# Altium project pay-optical.PrjPCB (part 1 of 2)
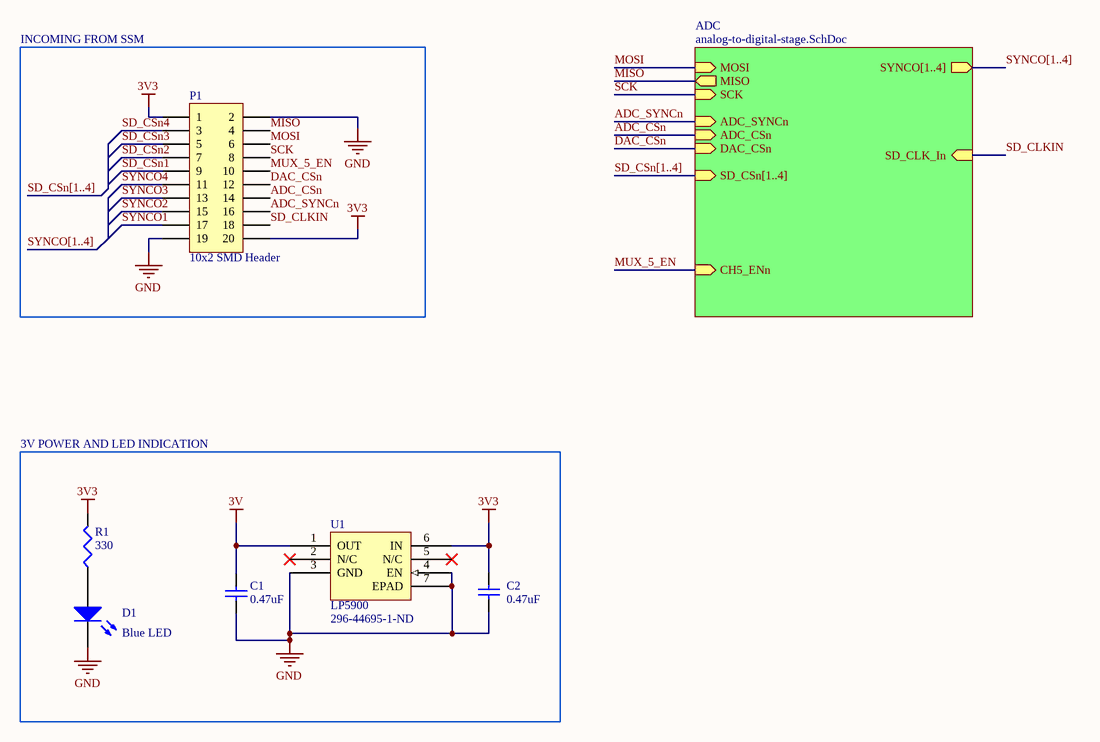
[diagram p0: pay-optical-toplevel.SchDoc]
13 sheets, 470 parts. Net scope: hierarchical (ports join the sheet entries above them; power ports are global).
Board files: pay-optical.PcbDoc, pay-optical-testing.PcbDoc
Sheets:
  pay-optical-toplevel.SchDoc
    ADC = analog-to-digital-stage.SchDoc
      ADC Converter = adc-ic.SchDoc
      Synchronous Demodulator Circuit = synchronous-demodulator.SchDoc
        CH1 = tia-channel-selection.SchDoc
          TIA_Signal_Mux = multiplexer-ic.SchDoc
          TIA1 = photodiode-amplifier.SchDoc
          TIA2 = photodiode-amplifier.SchDoc
          TIA3 = photodiode-amplifier.SchDoc
          TIA4 = photodiode-amplifier.SchDoc
          TIA5 = photodiode-amplifier.SchDoc
          TIA6 = photodiode-amplifier.SchDoc
          TIA7 = photodiode-amplifier.SchDoc
          TIA8 = photodiode-amplifier.SchDoc
          LED_Signal_Mux = multiplexer-ic.SchDoc
        CH2 = tia-channel-selection.SchDoc
          TIA_Signal_Mux = multiplexer-ic.SchDoc
          TIA1 = photodiode-amplifier.SchDoc
          TIA2 = photodiode-amplifier.SchDoc
          TIA3 = photodiode-amplifier.SchDoc
          TIA4 = photodiode-amplifier.SchDoc
          TIA5 = photodiode-amplifier.SchDoc
          TIA6 = photodiode-amplifier.SchDoc
          TIA7 = photodiode-amplifier.SchDoc
          TIA8 = photodiode-amplifier.SchDoc
          LED_Signal_Mux = multiplexer-ic.SchDoc
        CH3 = tia-channel-selection.SchDoc
          TIA_Signal_Mux = multiplexer-ic.SchDoc
          TIA1 = photodiode-amplifier.SchDoc
          TIA2 = photodiode-amplifier.SchDoc
          TIA3 = photodiode-amplifier.SchDoc
          TIA4 = photodiode-amplifier.SchDoc
          TIA5 = photodiode-amplifier.SchDoc
          TIA6 = photodiode-amplifier.SchDoc
          TIA7 = photodiode-amplifier.SchDoc
          TIA8 = photodiode-amplifier.SchDoc
          LED_Signal_Mux = multiplexer-ic.SchDoc
        SD1 = sync-demod-ic.SchDoc
        SD2 = sync-demod-ic.SchDoc
        SD3 = sync-demod-ic.SchDoc
        SD4 = sync-demod-ic.SchDoc
        HP_FILTER1 = highpass-filter-conditioning.SchDoc
        HP_FILTER2 = highpass-filter-conditioning.SchDoc
        HP_FILTER3 = highpass-filter-conditioning.SchDoc
        HP_FILTER4 = highpass-filter-conditioning.SchDoc
        CH4 = tia-channel-selection.SchDoc
          TIA_Signal_Mux = multiplexer-ic.SchDoc
          TIA1 = photodiode-amplifier.SchDoc
          TIA2 = photodiode-amplifier.SchDoc
          TIA3 = photodiode-amplifier.SchDoc
          TIA4 = photodiode-amplifier.SchDoc
          TIA5 = photodiode-amplifier.SchDoc
          TIA6 = photodiode-amplifier.SchDoc
          TIA7 = photodiode-amplifier.SchDoc
          TIA8 = photodiode-amplifier.SchDoc
          LED_Signal_Mux = multiplexer-ic.SchDoc
        CH5 = special-channel-selection.SchDoc
          TIA_Signal_Mux = multiplexer-ic.SchDoc
          TIA_S1 = photodiode-amplifier.SchDoc
          TIA_S2 = photodiode-amplifier.SchDoc
          LED_Signal_Mux = multiplexer-ic.SchDoc
          SMA Amp = sma-amplifier.SchDoc
      LPF_P1 = lowpass-adc-input.SchDoc
      LPF_P2 = lowpass-adc-input.SchDoc
      LPF_P3 = lowpass-adc-input.SchDoc
      LPF_P4 = lowpass-adc-input.SchDoc
      Designator = dac-ic.SchDoc
      LPF_N1 = lowpass-adc-input.SchDoc
      LPF_N2 = lowpass-adc-input.SchDoc
      LPF_N3 = lowpass-adc-input.SchDoc
      LPF_N4 = lowpass-adc-input.SchDoc

## Sheet pay-optical-toplevel.SchDoc: PAY Optical Top Level
size A4; DrawnBy: Dylan Vogel; Organization: UTAT SS; DocumentNumber: 1; Revision: 2; SheetNumber: 1; SheetTotal: 13

### Parts
C1  0.47uF  [1608[0603]]
C2  0.47uF  [1608[0603]]
D1  Blue LED  [0603-LED]
P1  10x2 SMD Header  [CON20_2X10_DUA00]
R1  330  [0402]
U1  LP5900  Supplier Part Number 1: 296-44695-1-ND  [DFN220X250X80-7N]

### Blocks framed on the sheet
INCOMING FROM SSM: P1
3V POWER AND LED INDICATION: C1 C2 D1 R1 U1

### Sub-sheets
ADC = analog-to-digital-stage.SchDoc: SCK (in), MISO (out), MOSI (in), ADC_SYNCn (in), ADC_CSn (in), DAC_CSn (in), CH5_ENn (in), SD_CLK_In (in), SD_CSn[1..4] (in), SYNCO[1..4] (out)

### Nets
3V: C1.2 U1.1(OUT)
3V3: C2.2 P1.1 P1.20 R1.2 U1.6(IN)
GND: C1.1 C2.1 D1.2(K) P1.2 P1.19 U1.3(GND) U1.4(EN) U1.7(EPAD)
ADC_CSn: P1.14 ; sheet ADC/ADC_CSn
ADC_SYNCn: P1.16 ; sheet ADC/ADC_SYNCn
DAC_CSn: P1.12 ; sheet ADC/DAC_CSn
MISO: P1.4 ; sheet ADC/MISO
MOSI: P1.6 ; sheet ADC/MOSI
MUX_5_EN: P1.10 ; sheet ADC/CH5_ENn
SCK: P1.8 ; sheet ADC/SCK
SD_CLKIN: P1.18 ; sheet ADC/SD_CLK_In
SD_CSn1: P1.9
SD_CSn2: P1.7
SD_CSn3: P1.5
SD_CSn4: P1.3
SYNCO1: P1.17
SYNCO2: P1.15
SYNCO3: P1.13
SYNCO4: P1.11
NetD1_1: D1.1(A) R1.1

Not connected (* = marked no-connect by the designer): U1 2(N/C)* 5(N/C)*

### Buses and harness runs
bus SD_CSn[1..4]
bus SD_CSn[1..4] = sheet ADC/SD_CSn[1..4]
bus SYNCO[1..4]
bus SYNCO[1..4] = sheet ADC/SYNCO[1..4]

### Library data of the parts
C1 C2 = Cap Semi: Capacitor (Semiconductor SIM Model); Published: 8-Jun-2000; LatestRevisionDate: 29-May-2009; LatestRevisionNote: IPC-7351 Footprint Added.; PackageReference: C1206; Publisher: Altium Limited; PackageDescription: Chip Capacitor; Value: 0.47uF; Supplier: Digi-Key; Supplier 1: Digi-Key
D1 = LED2: Typical RED, GREEN, YELLOW, AMBER GaAs LED; Published: 8-Jun-2000; LatestRevisionDate: 17-Jul-2002; LatestRevisionNote: Re-released for DXP Platform.; PackageVersion: Feb-2002; PackageReference: 3.2X1.6X1.1; Publisher: Altium Limited; PackageDescription: SM LED; 2 Flat Leads; Supplier 1: Digi-Key
P1 = Header 10X2: 10x2 SMD 50mil Incoming from SSM; LatestRevisionDate: 17-Jul-2002; LatestRevisionNote: Re-released for DXP Platform.; Publisher: Altium Limited; Supplier 1: Digi-Key; Supplier Part Number 1: SAM11274-ND
R1 = Res3: Power indication LED; Published: 8-Jun-2000; LatestRevisionDate: 29-May-2009; LatestRevisionNote: IPC-7351 Footprint Added.; PackageReference: J1-0603; Publisher: Altium Limited; PackageDescription: Chip Resistor; Value: 330; Supplier 1: Digi-Key
U1 = LP5900: Low noise 3V low dropout regulator for analog and RF applications.; Supplier 1: Digi-Key

## Sheet analog-to-digital-stage.SchDoc: ADC Top Level
size A4; DrawnBy: Dylan Vogel; Organization: UTAT SS; DocumentNumber: 2; Revision: 2; SheetNumber: 2; SheetTotal: 13
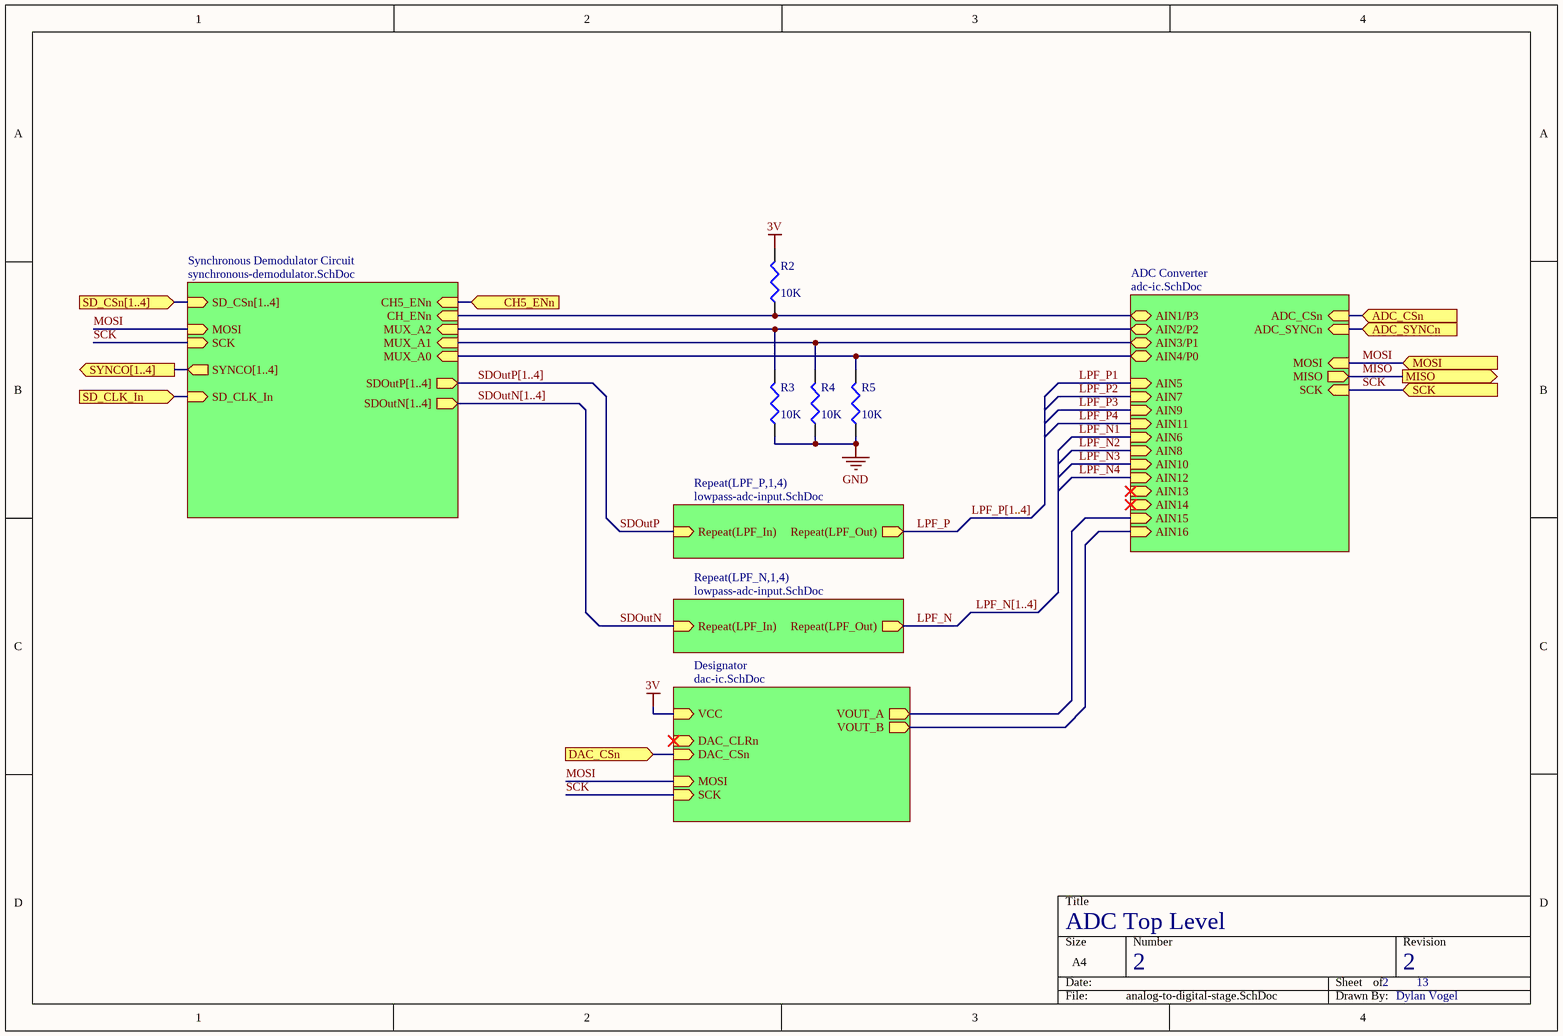
[diagram p1: analog-to-digital-stage.SchDoc]

### Parts
R2  10K  [J1-0603]
R3  10K  [J1-0603]
R4  10K  [J1-0603]
R5  10K  [J1-0603]

### Sub-sheets
ADC Converter = adc-ic.SchDoc: AIN6 (in), MISO (out), AIN3/P1 (bidir), AIN11 (in), ADC_CSn (in), ADC_SYNCn (in), AIN1/P3 (bidir), AIN5 (in), SCK (in), AIN2/P2 (bidir), AIN8 (in), MOSI (in), AIN12 (in), AIN14 (in), AIN9 (in), AIN10 (in), AIN7 (in), AIN16 (in), AIN13 (in), AIN15 (in), AIN4/P0 (bidir)
Designator = dac-ic.SchDoc: VCC (in), DAC_CLRn (in), MOSI (in), SCK (in), DAC_CSn (in), VOUT_B (out), VOUT_A (out)
Repeat(LPF_N,1,4) = lowpass-adc-input.SchDoc: Repeat(LPF_Out) (out), Repeat(LPF_In) (in)
Repeat(LPF_P,1,4) = lowpass-adc-input.SchDoc: Repeat(LPF_Out) (out), Repeat(LPF_In) (in)
Synchronous Demodulator Circuit = synchronous-demodulator.SchDoc: SCK (in), MUX_A0 (in), MUX_A1 (in), CH_ENn (in), MOSI (in), CH5_ENn (in), MUX_A2 (in), SD_CLK_In (in), SD_CSn[1..4] (in), SDOutN[1..4] (out), SDOutP[1..4] (out), SYNCO[1..4] (out)

### Ports
ADC_CSn (in), ADC_SYNCn (in), CH5_ENn (in), DAC_CSn (in), MISO (out), MOSI (in), SCK (in), SD_CLK_In (in), SD_CSn[1..4] (in), SYNCO[1..4] (out)

### Nets
3V: R2.2 ; sheet Designator/VCC
GND: R3.1 R4.1 R5.1
ADC_CSn: port ADC_CSn, sheet ADC Converter/ADC_CSn
ADC_SYNCn: port ADC_SYNCn, sheet ADC Converter/ADC_SYNCn
AIN1/P3: R2.1 ; sheet ADC Converter/AIN1/P3, sheet Synchronous Demodulator Circuit/CH_ENn
AIN2/P2: R3.2 ; sheet ADC Converter/AIN2/P2, sheet Synchronous Demodulator Circuit/MUX_A2
AIN3/P1: R4.2 ; sheet ADC Converter/AIN3/P1, sheet Synchronous Demodulator Circuit/MUX_A1
AIN4/P0: R5.2 ; sheet ADC Converter/AIN4/P0, sheet Synchronous Demodulator Circuit/MUX_A0
AIN15: sheet ADC Converter/AIN15, sheet Designator/VOUT_A
AIN16: sheet ADC Converter/AIN16, sheet Designator/VOUT_B
DAC_CSn: port DAC_CSn, sheet Designator/DAC_CSn
LPF_N: sheet Repeat(LPF_N,1,4)/Repeat(LPF_Out)
LPF_P: sheet Repeat(LPF_P,1,4)/Repeat(LPF_Out)
MISO: port MISO, sheet ADC Converter/MISO
MOSI: port MOSI, sheet ADC Converter/MOSI, sheet Synchronous Demodulator Circuit/MOSI, sheet Designator/MOSI
MUX_5_EN: port CH5_ENn, sheet Synchronous Demodulator Circuit/CH5_ENn
SCK: port SCK, sheet ADC Converter/SCK, sheet Synchronous Demodulator Circuit/SCK, sheet Designator/SCK
SD_CLKIN: port SD_CLK_In, sheet Synchronous Demodulator Circuit/SD_CLK_In
SDOutN: sheet Repeat(LPF_N,1,4)/Repeat(LPF_In)
SDOutP: sheet Repeat(LPF_P,1,4)/Repeat(LPF_In)

### Buses and harness runs
bus LPF_N[1..4]
bus LPF_P[1..4]
bus port SD_CSn[1..4] = sheet Synchronous Demodulator Circuit/SD_CSn[1..4]
bus port SYNCO[1..4] = sheet Synchronous Demodulator Circuit/SYNCO[1..4]
bus SDOutN[1..4] = sheet Synchronous Demodulator Circuit/SDOutN[1..4]
bus SDOutP[1..4] = sheet Synchronous Demodulator Circuit/SDOutP[1..4]

### Library data of the parts
R2 = Res3: 10K pull-up for MUX ENn pin; Published: 8-Jun-2000; LatestRevisionDate: 29-May-2009; LatestRevisionNote: IPC-7351 Footprint Added.; PackageReference: J1-0603; Publisher: Altium Limited; PackageDescription: Chip Resistor; Value: 10K
R3-R5 = Res3: 10K pulldown on MUX channel selection; Published: 8-Jun-2000; LatestRevisionDate: 29-May-2009; LatestRevisionNote: IPC-7351 Footprint Added.; PackageReference: J1-0603; Publisher: Altium Limited; PackageDescription: Chip Resistor; Value: 10K

## Sheet adc-ic.SchDoc: AD7194
size A4; DrawnBy: Dylan Vogel; Organization: UTAT SS; DocumentNumber: 3; Revision: 2; SheetNumber: 3; SheetTotal: 13
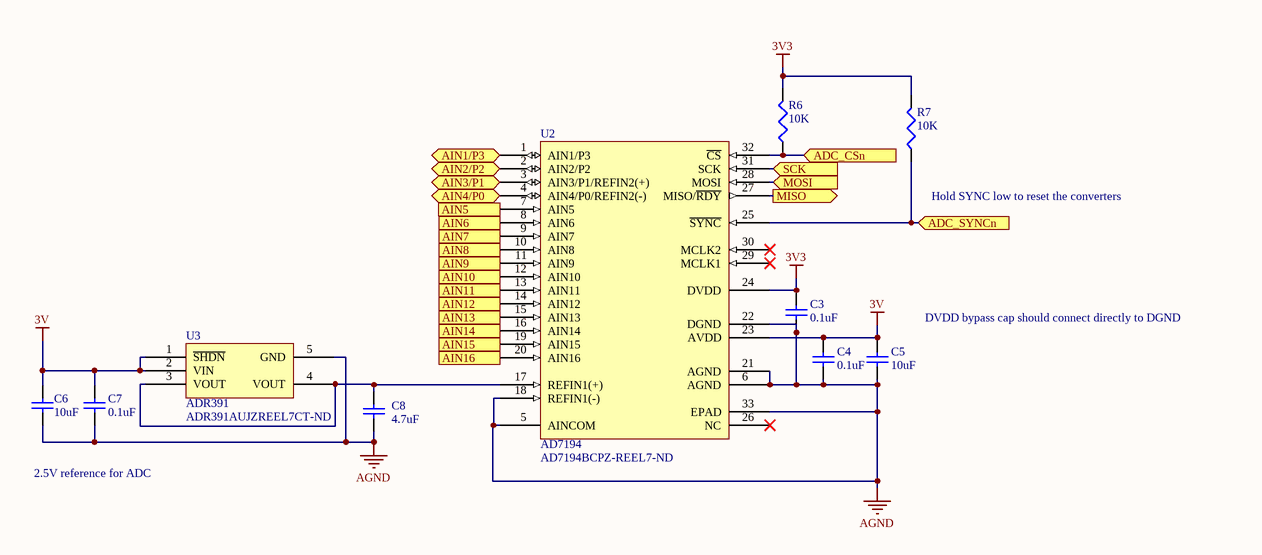
[diagram p2: adc-ic.SchDoc]

### Parts
C3  0.1uF  [0402]
C4  0.1uF  [0402]
C5  10uF  [1608[0603]]
C6  10uF  [1608[0603]]
C7  0.1uF  [0402]
C8  4.7uF  [1608[0603]]
R6  10K  [0402]
R7  10K  [0402]
U2  AD7194  Supplier Part Number 1: AD7194BCPZ-REEL7-ND
U3  ADR391  Supplier Part Number 1: ADR391AUJZREEL7CT-ND  [SOT-23-5_95P290X160-5N]

### Ports
ADC_CSn (in), ADC_SYNCn (in), AIN1/P3 (bidir), AIN2/P2 (bidir), AIN3/P1 (bidir), AIN4/P0 (bidir), AIN5 (in), AIN6 (in), AIN7 (in), AIN8 (in), AIN9 (in), AIN10 (in), AIN11 (in), AIN12 (in), AIN13 (in), AIN14 (in), AIN15 (in), AIN16 (in), MISO (out), MOSI (in), SCK (in)

### Nets
3V: C4.2 C5.2 C6.2 C7.2 U2.23(AVDD) U3.1(~{SHDN}) U3.2(VIN)
3V3: C3.2 R6.2 R7.2 U2.24(DVDD)
AGND: C3.1 C4.1 C5.1 C6.1 C7.1 C8.1 U2.5(AINCOM) U2.6(AGND) U2.18(REFIN1(-)) U2.21(AGND) U2.22(DGND) U2.33(EPAD) U3.5(GND)
ADC_CSn: R6.1 U2.32(~{CS}) ; port ADC_CSn
ADC_SYNCn: R7.1 U2.25(~{SYNC}) ; port ADC_SYNCn
AIN1/P3: U2.1(AIN1/P3) ; port AIN1/P3
AIN2/P2: U2.2(AIN2/P2) ; port AIN2/P2
AIN3/P1: U2.3(AIN3/P1/REFIN2(+)) ; port AIN3/P1
AIN4/P0: U2.4(AIN4/P0/REFIN2(-)) ; port AIN4/P0
AIN13: U2.15(AIN13) ; port AIN13
AIN14: U2.16(AIN14) ; port AIN14
AIN15: U2.19(AIN15) ; port AIN15
AIN16: U2.20(AIN16) ; port AIN16
LPF_N1: U2.8(AIN6) ; port AIN6
LPF_N2: U2.10(AIN8) ; port AIN8
LPF_N3: U2.12(AIN10) ; port AIN10
LPF_N4: U2.14(AIN12) ; port AIN12
LPF_P1: U2.7(AIN5) ; port AIN5
LPF_P2: U2.9(AIN7) ; port AIN7
LPF_P3: U2.11(AIN9) ; port AIN9
LPF_P4: U2.13(AIN11) ; port AIN11
MISO: U2.27(MISO/~{RDY}) ; port MISO
MOSI: U2.28(MOSI) ; port MOSI
SCK: U2.31(SCK) ; port SCK
NetC8_2: C8.2 U2.17(REFIN1(+)) U3.3(VOUT) U3.4(VOUT)

Not connected (* = marked no-connect by the designer): U2 26(NC)* 29(MCLK1)* 30(MCLK2)*

### Notes on the sheet
- (near R7) Hold SYNC low to reset the converters
- DVDD bypass cap should connect directly to DGND
- 2.5V reference for ADC

### Library data of the parts
C3-C8 = Cap Semi: Capacitor (Semiconductor SIM Model); Published: 8-Jun-2000; LatestRevisionDate: 29-May-2009; LatestRevisionNote: IPC-7351 Footprint Added.; PackageReference: C1206; Publisher: Altium Limited; PackageDescription: Chip Capacitor; Supplier: Digi-Key; Supplier 1: Digi-Key
  C3 C4 C7: Value: 0.1uF
  C5 C6: Value: 10uF
  C8: Value: 4.7uF
R6 R7 = Res3: Resistor; Published: 8-Jun-2000; LatestRevisionDate: 29-May-2009; LatestRevisionNote: IPC-7351 Footprint Added.; PackageReference: J1-0603; Publisher: Altium Limited; PackageDescription: Chip Resistor; Value: 10K; Supplier: Digi-Key; Supplier 1: Digi-Key
U2 = AD7194: 24-bit sigma-delta ADC; Supplier 1: Digi-Key
U3 = ADR391: 2.5V reference voltage.; Supplier 1: Digi-Key; Supplier: Digi-Key

## Sheet synchronous-demodulator.SchDoc: SD Top Level
size A4; DrawnBy: Dylan Vogel; Organization: UTAT SS; DocumentNumber: 6; Revision: 2; SheetNumber: 6; SheetTotal: 13
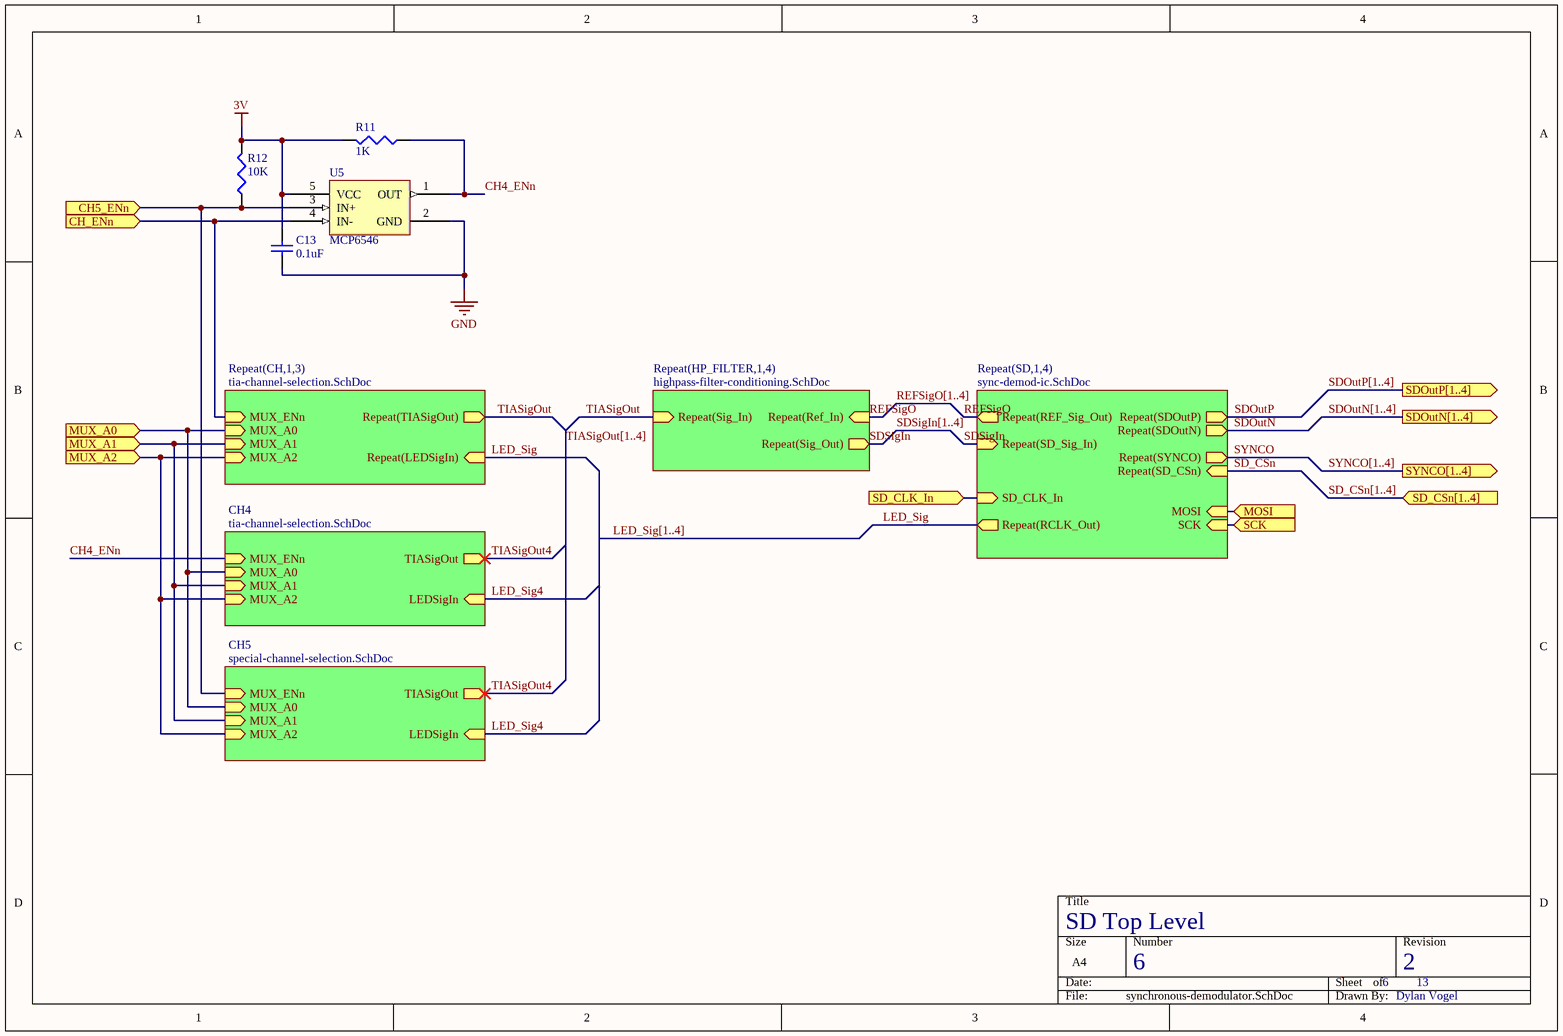
[diagram p3: synchronous-demodulator.SchDoc]

### Parts
C13  0.1uF  [0402]
R11  1K  [0402]
R12  10K  [0402]
U5  MCP6546  [SOT-23-5_95P290X160-5N]

### Sub-sheets
CH4 = tia-channel-selection.SchDoc: MUX_ENn (in), MUX_A0 (in), MUX_A1 (in), TIASigOut (out), MUX_A2 (in), LEDSigIn (in)
CH5 = special-channel-selection.SchDoc: MUX_ENn (in), MUX_A0 (in), MUX_A1 (in), TIASigOut (out), MUX_A2 (in), LEDSigIn (in)  | Channel: 5
Repeat(CH,1,3) = tia-channel-selection.SchDoc: MUX_ENn (in), MUX_A0 (in), MUX_A1 (in), Repeat(TIASigOut) (out), MUX_A2 (in), Repeat(LEDSigIn) (in)
Repeat(HP_FILTER,1,4) = highpass-filter-conditioning.SchDoc: Repeat(Ref_In) (in), Repeat(Sig_Out) (out), Repeat(Sig_In) (in)
Repeat(SD,1,4) = sync-demod-ic.SchDoc: Repeat(SDOutP) (out), Repeat(SD_CSn) (in), Repeat(SDOutN) (out), Repeat(RCLK_Out) (out), SD_CLK_In (in), Repeat(SYNCO) (out), Repeat(SD_Sig_In) (in), MOSI (in), SCK (in), Repeat(REF_Sig_Out) (out)

### Ports
CH5_ENn (in), CH_ENn (in), MOSI (in), MUX_A0 (in), MUX_A1 (in), MUX_A2 (in), SCK (in), SD_CLK_In (in), SD_CSn[1..4] (in), SDOutN[1..4] (out), SDOutP[1..4] (out), SYNCO[1..4] (out)

### Nets
3V: C13.2 R11.2 R12.2 U5.5(VCC)
GND: C13.1 U5.2(GND)
AIN1/P3: U5.4(IN-) ; port CH_ENn, sheet Repeat(CH,1,3)/MUX_ENn
AIN2/P2: port MUX_A2, sheet Repeat(CH,1,3)/MUX_A2, sheet CH4/MUX_A2, sheet CH5/MUX_A2
AIN3/P1: port MUX_A1, sheet Repeat(CH,1,3)/MUX_A1, sheet CH4/MUX_A1, sheet CH5/MUX_A1
AIN4/P0: port MUX_A0, sheet Repeat(CH,1,3)/MUX_A0, sheet CH4/MUX_A0, sheet CH5/MUX_A0
CH4_ENn: R11.1 U5.1(OUT) ; sheet CH4/MUX_ENn
LED_Sig: sheet Repeat(CH,1,3)/Repeat(LEDSigIn), sheet Repeat(SD,1,4)/Repeat(RCLK_Out)
LED_Sig4: sheet CH4/LEDSigIn, sheet CH5/LEDSigIn
MOSI: port MOSI, sheet Repeat(SD,1,4)/MOSI
MUX_5_EN: R12.1 U5.3(IN+) ; port CH5_ENn, sheet CH5/MUX_ENn
REFSigO: sheet Repeat(SD,1,4)/Repeat(REF_Sig_Out), sheet Repeat(HP_FILTER,1,4)/Repeat(Ref_In)
SCK: port SCK, sheet Repeat(SD,1,4)/SCK
SD_CLKIN: port SD_CLK_In, sheet Repeat(SD,1,4)/SD_CLK_In
SD_CSn: sheet Repeat(SD,1,4)/Repeat(SD_CSn)
SDOutN: sheet Repeat(SD,1,4)/Repeat(SDOutN)
SDOutP: sheet Repeat(SD,1,4)/Repeat(SDOutP)
SDSigIn: sheet Repeat(SD,1,4)/Repeat(SD_Sig_In), sheet Repeat(HP_FILTER,1,4)/Repeat(Sig_Out)
SYNCO: sheet Repeat(SD,1,4)/Repeat(SYNCO)
TIASigOut: sheet Repeat(CH,1,3)/Repeat(TIASigOut), sheet Repeat(HP_FILTER,1,4)/Repeat(Sig_In)
TIASigOut4: sheet CH4/TIASigOut, sheet CH5/TIASigOut

### Buses and harness runs
bus LED_Sig[1..4]
bus REFSigO[1..4]
bus SD_CSn[1..4] = port SD_CSn[1..4]
bus SDOutN[1..4] = port SDOutN[1..4]
bus SDOutP[1..4] = port SDOutP[1..4]
bus SDSigIn[1..4]
bus SYNCO[1..4] = port SYNCO[1..4]
bus TIASigOut[1..4]

### Library data of the parts
C13 = Cap Semi: Capacitor (Semiconductor SIM Model); Published: 8-Jun-2000; LatestRevisionDate: 29-May-2009; LatestRevisionNote: IPC-7351 Footprint Added.; PackageReference: C1206; Publisher: Altium Limited; PackageDescription: Chip Capacitor; Value: 0.1uF; Supplier 1: Digi-Key
R11 R12 = Res3: Resistor; Published: 8-Jun-2000; LatestRevisionDate: 29-May-2009; LatestRevisionNote: IPC-7351 Footprint Added.; PackageReference: J1-0603; Publisher: Altium Limited; PackageDescription: Chip Resistor; Supplier 1: Digi-Key
  R11: Value: 1K
  R12: Value: 10K
U5 = MCP6546: Open-drain output sub-microamp comparator.; Supplier 1: Digi-Key; Supplier Part Number 1: MCP6546T-E/OTCT-ND

## Sheet tia-channel-selection.SchDoc: TIA Channel Selection
size A4; DrawnBy: Dylan Vogel; Organization: UTAT SS; DocumentNumber: 7; Revision: 2; SheetNumber: 7; SheetTotal: 13
Used 4 times, as channels ADC/Synchronous Demodulator Circuit/CH1, ADC/Synchronous Demodulator Circuit/CH2, ADC/Synchronous Demodulator Circuit/CH3, ADC/Synchronous Demodulator Circuit/CH4. Parts and nets are listed once, with the designators drawn on the sheet.
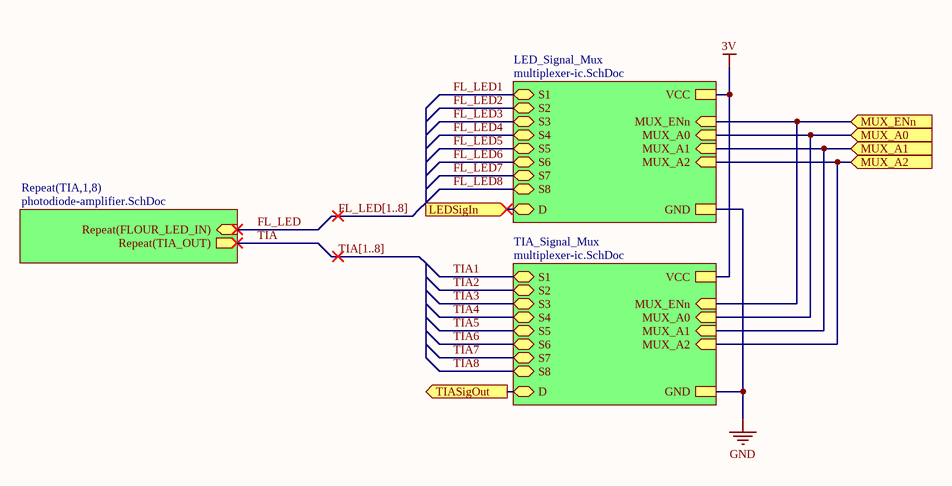
[diagram p4: tia-channel-selection.SchDoc]

### Sub-sheets
LED_Signal_Mux = multiplexer-ic.SchDoc: S7 (bidir), D (bidir), S3 (bidir), S1 (bidir), S4 (bidir), MUX_ENn (in), S2 (bidir), VCC, GND, S8 (bidir), S6 (bidir), MUX_A1 (in), MUX_A0 (in), S5 (bidir), MUX_A2 (in)
Repeat(TIA,1,8) = photodiode-amplifier.SchDoc: Repeat(FLOUR_LED_IN) (in), Repeat(TIA_OUT) (out)
TIA_Signal_Mux = multiplexer-ic.SchDoc: S7 (bidir), D (bidir), S3 (bidir), S1 (bidir), S4 (bidir), MUX_ENn (in), S2 (bidir), VCC, GND, S8 (bidir), S6 (bidir), MUX_A1 (in), MUX_A0 (in), S5 (bidir), MUX_A2 (in)

### Ports
LEDSigIn (in), MUX_A0 (in), MUX_A1 (in), MUX_A2 (in), MUX_ENn (in), TIASigOut (out)

### Nets
3V: sheet TIA_Signal_Mux/VCC, sheet LED_Signal_Mux/VCC
GND: sheet TIA_Signal_Mux/GND, sheet LED_Signal_Mux/GND
FL_LED: sheet Repeat(TIA,1,8)/Repeat(FLOUR_LED_IN)
FL_LED1: sheet LED_Signal_Mux/S1
FL_LED2: sheet LED_Signal_Mux/S2
FL_LED3: sheet LED_Signal_Mux/S3
FL_LED4: sheet LED_Signal_Mux/S4
FL_LED5: sheet LED_Signal_Mux/S5
FL_LED6: sheet LED_Signal_Mux/S6
FL_LED7: sheet LED_Signal_Mux/S7
FL_LED8: sheet LED_Signal_Mux/S8
LEDSigIn: port LEDSigIn, sheet LED_Signal_Mux/D
MUX_A0: port MUX_A0, sheet TIA_Signal_Mux/MUX_A0, sheet LED_Signal_Mux/MUX_A0
MUX_A1: port MUX_A1, sheet TIA_Signal_Mux/MUX_A1, sheet LED_Signal_Mux/MUX_A1
MUX_A2: port MUX_A2, sheet TIA_Signal_Mux/MUX_A2, sheet LED_Signal_Mux/MUX_A2
MUX_ENn: port MUX_ENn, sheet TIA_Signal_Mux/MUX_ENn, sheet LED_Signal_Mux/MUX_ENn
TIA: sheet Repeat(TIA,1,8)/Repeat(TIA_OUT)
TIA1: sheet TIA_Signal_Mux/S1
TIA2: sheet TIA_Signal_Mux/S2
TIA3: sheet TIA_Signal_Mux/S3
TIA4: sheet TIA_Signal_Mux/S4
TIA5: sheet TIA_Signal_Mux/S5
TIA6: sheet TIA_Signal_Mux/S6
TIA7: sheet TIA_Signal_Mux/S7
TIA8: sheet TIA_Signal_Mux/S8
TIASigOut: port TIASigOut, sheet TIA_Signal_Mux/D

### Channels
ADC/Synchronous Demodulator Circuit/CH1: ports LEDSigIn=LED_Sig1 MUX_A0=AIN4/P0 MUX_A1=AIN3/P1 MUX_A2=AIN2/P2 MUX_ENn=AIN1/P3 TIASigOut=TIASigOut1
ADC/Synchronous Demodulator Circuit/CH2: ports LEDSigIn=LED_Sig2 MUX_A0=AIN4/P0 MUX_A1=AIN3/P1 MUX_A2=AIN2/P2 MUX_ENn=AIN1/P3 TIASigOut=TIASigOut2
ADC/Synchronous Demodulator Circuit/CH3: ports LEDSigIn=LED_Sig3 MUX_A0=AIN4/P0 MUX_A1=AIN3/P1 MUX_A2=AIN2/P2 MUX_ENn=AIN1/P3 TIASigOut=TIASigOut3
ADC/Synchronous Demodulator Circuit/CH4: ports LEDSigIn=LED_Sig4 MUX_A0=AIN4/P0 MUX_A1=AIN3/P1 MUX_A2=AIN2/P2 MUX_ENn=CH4_ENn TIASigOut=TIASigOut4

### Buses and harness runs
bus FL_LED[1..8]
bus TIA[1..8]

## Sheet multiplexer-ic.SchDoc: ADG658
size A4; DrawnBy: Dylan Vogel; Organization: UTAT SS; DocumentNumber: 13; Revision: 2; SheetNumber: 13; SheetTotal: 13
Used 10 times, as channels ADC/Synchronous Demodulator Circuit/CH1/TIA_Signal_Mux, ADC/Synchronous Demodulator Circuit/CH1/LED_Signal_Mux, ADC/Synchronous Demodulator Circuit/CH2/TIA_Signal_Mux, ADC/Synchronous Demodulator Circuit/CH2/LED_Signal_Mux, ADC/Synchronous Demodulator Circuit/CH3/TIA_Signal_Mux, ADC/Synchronous Demodulator Circuit/CH3/LED_Signal_Mux, ADC/Synchronous Demodulator Circuit/CH4/TIA_Signal_Mux, ADC/Synchronous Demodulator Circuit/CH4/LED_Signal_Mux, ADC/Synchronous Demodulator Circuit/CH5/TIA_Signal_Mux, ADC/Synchronous Demodulator Circuit/CH5/LED_Signal_Mux. Parts and nets are listed once, with the designators drawn on the sheet.
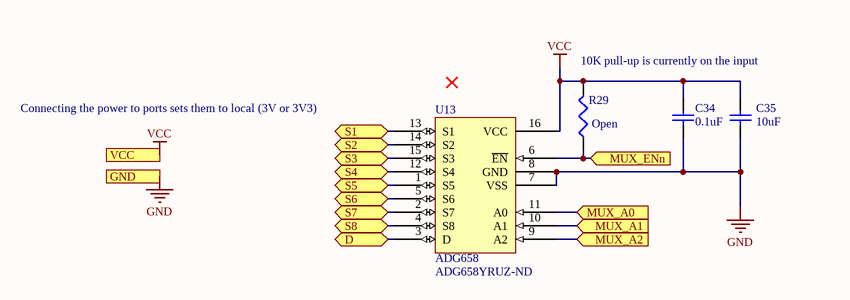
[diagram p5: multiplexer-ic.SchDoc]

### Parts
C34  0.1uF  [0402]
C35  10uF  [1608[0603]]
R29  value Open  [0402]  (hidden comment: Optional 10K)
U13  ADG658  Supplier Part Number 1: ADG658YRUZ-ND  [SSOP16_N]

### Ports
D (bidir), GND, MUX_A0 (in), MUX_A1 (in), MUX_A2 (in), MUX_ENn (in), S1 (bidir), S2 (bidir), S3 (bidir), S4 (bidir), S5 (bidir), S6 (bidir), S7 (bidir), S8 (bidir), VCC

### Nets
GND: C34.1 C35.1 U13.7(VSS) U13.8(GND) ; port GND
VCC: C34.2 C35.2 R29.2 U13.16(VCC) ; port VCC
D: U13.3(D) ; port D
MUX_A0: U13.11(A0) ; port MUX_A0
MUX_A1: U13.10(A1) ; port MUX_A1
MUX_A2: U13.9(A2) ; port MUX_A2
MUX_ENn: R29.1 U13.6(~{EN}) ; port MUX_ENn
S1: U13.13(S1) ; port S1
S2: U13.14(S2) ; port S2
S3: U13.15(S3) ; port S3
S4: U13.12(S4) ; port S4
S5: U13.1(S5) ; port S5
S6: U13.5(S6) ; port S6
S7: U13.2(S7) ; port S7
S8: U13.4(S8) ; port S8

### Channels
ADC/Synchronous Demodulator Circuit/CH1/TIA_Signal_Mux: designators end in _TIA_Signal_Mux1; ports D=TIASigOut1 GND=GND MUX_A0=AIN4/P0 MUX_A1=AIN3/P1 MUX_A2=AIN2/P2 MUX_ENn=AIN1/P3 S1=TIA1_CH1 S2=TIA2_CH1 S3=TIA3_CH1 S4=TIA4_CH1 S5=TIA5_CH1 S6=TIA6_CH1 S7=TIA7_CH1 S8=TIA8_CH1 VCC=3V
ADC/Synchronous Demodulator Circuit/CH1/LED_Signal_Mux: designators end in _LED_Signal_Mux1; ports D=LED_Sig1 GND=GND MUX_A0=AIN4/P0 MUX_A1=AIN3/P1 MUX_A2=AIN2/P2 MUX_ENn=AIN1/P3 S1=FL_LED1_CH1 S2=FL_LED2_CH1 S3=FL_LED3_CH1 S4=FL_LED4_CH1 S5=FL_LED5_CH1 S6=FL_LED6_CH1 S7=FL_LED7_CH1 S8=FL_LED8_CH1 VCC=3V
ADC/Synchronous Demodulator Circuit/CH2/TIA_Signal_Mux: designators end in _TIA_Signal_Mux2; ports D=TIASigOut2 GND=GND MUX_A0=AIN4/P0 MUX_A1=AIN3/P1 MUX_A2=AIN2/P2 MUX_ENn=AIN1/P3 S1=TIA1_CH2 S2=TIA2_CH2 S3=TIA3_CH2 S4=TIA4_CH2 S5=TIA5_CH2 S6=TIA6_CH2 S7=TIA7_CH2 S8=TIA8_CH2 VCC=3V
ADC/Synchronous Demodulator Circuit/CH2/LED_Signal_Mux: designators end in _LED_Signal_Mux2; ports D=LED_Sig2 GND=GND MUX_A0=AIN4/P0 MUX_A1=AIN3/P1 MUX_A2=AIN2/P2 MUX_ENn=AIN1/P3 S1=FL_LED1_CH2 S2=FL_LED2_CH2 S3=FL_LED3_CH2 S4=FL_LED4_CH2 S5=FL_LED5_CH2 S6=FL_LED6_CH2 S7=FL_LED7_CH2 S8=FL_LED8_CH2 VCC=3V
ADC/Synchronous Demodulator Circuit/CH3/TIA_Signal_Mux: designators end in _TIA_Signal_Mux3; ports D=TIASigOut3 GND=GND MUX_A0=AIN4/P0 MUX_A1=AIN3/P1 MUX_A2=AIN2/P2 MUX_ENn=AIN1/P3 S1=TIA1_CH3 S2=TIA2_CH3 S3=TIA3_CH3 S4=TIA4_CH3 S5=TIA5_CH3 S6=TIA6_CH3 S7=TIA7_CH3 S8=TIA8_CH3 VCC=3V
ADC/Synchronous Demodulator Circuit/CH3/LED_Signal_Mux: designators end in _LED_Signal_Mux3; ports D=LED_Sig3 GND=GND MUX_A0=AIN4/P0 MUX_A1=AIN3/P1 MUX_A2=AIN2/P2 MUX_ENn=AIN1/P3 S1=FL_LED1_CH3 S2=FL_LED2_CH3 S3=FL_LED3_CH3 S4=FL_LED4_CH3 S5=FL_LED5_CH3 S6=FL_LED6_CH3 S7=FL_LED7_CH3 S8=FL_LED8_CH3 VCC=3V
ADC/Synchronous Demodulator Circuit/CH4/TIA_Signal_Mux: designators end in _TIA_Signal_Mux4; ports D=TIASigOut4 GND=GND MUX_A0=AIN4/P0 MUX_A1=AIN3/P1 MUX_A2=AIN2/P2 MUX_ENn=CH4_ENn S1=TIA1_CH4 S2=TIA2_CH4 S3=TIA3_CH4 S4=TIA4_CH4 S5=TIA5_CH4 S6=TIA6_CH4 S7=TIA7_CH4 S8=TIA8_CH4 VCC=3V
ADC/Synchronous Demodulator Circuit/CH4/LED_Signal_Mux: designators end in _LED_Signal_Mux4; ports D=LED_Sig4 GND=GND MUX_A0=AIN4/P0 MUX_A1=AIN3/P1 MUX_A2=AIN2/P2 MUX_ENn=CH4_ENn S1=FL_LED1_CH4 S2=FL_LED2_CH4 S3=FL_LED3_CH4 S4=FL_LED4_CH4 S5=FL_LED5_CH4 S6=FL_LED6_CH4 S7=FL_LED7_CH4 S8=FL_LED8_CH4 VCC=3V
ADC/Synchronous Demodulator Circuit/CH5/TIA_Signal_Mux: designators end in _TIA_Signal_Mux5; ports D=TIASigOut4 GND=GND MUX_A0=AIN4/P0 MUX_A1=AIN3/P1 MUX_A2=AIN2/P2 MUX_ENn=MUX_5_EN S1=S_TIA1 S2=S_TIA2 S3=S3 S4=S3 S5=S3 S6=S3 S7=S3 S8=S3 VCC=3V
ADC/Synchronous Demodulator Circuit/CH5/LED_Signal_Mux: designators end in _LED_Signal_Mux5; ports D=LED_Sig4 GND=GND MUX_A0=AIN4/P0 MUX_A1=AIN3/P1 MUX_A2=AIN2/P2 MUX_ENn=MUX_5_EN S1=S_FL_LED1 S2=S_FL_LED2 S3=S3 S4=S4 S5=S5 S6=S5 S7=S5 S8=S5 VCC=3V

### Notes on the sheet
- 10K pull-up is currently on the input
- (near U13) Connecting the power to ports sets them to local (3V or 3V3)

### Library data of the parts
C34 C35 = Cap Semi: Capacitor (Semiconductor SIM Model); Published: 8-Jun-2000; LatestRevisionDate: 29-May-2009; LatestRevisionNote: IPC-7351 Footprint Added.; PackageReference: C1206; Publisher: Altium Limited; PackageDescription: Chip Capacitor; Supplier: Digi-Key; Supplier 1: Digi-Key
  C34: Value: 0.1uF
  C35: Value: 10uF
R29 = Res3: Resistor; Published: 8-Jun-2000; LatestRevisionDate: 29-May-2009; LatestRevisionNote: IPC-7351 Footprint Added.; PackageReference: J1-0603; Publisher: Altium Limited; PackageDescription: Chip Resistor; Supplier: Digi-Key; Supplier 1: Digi-Key
U13 = ADG658: Eight channel analog multiplexer.; Supplier 1: Digi-Key; Supplier: Digi-Key

## Sheet photodiode-amplifier.SchDoc: Photodiode Transimpedance Amplifier
size A4; DrawnBy: Dylan Vogel; Organization: UTAT SS; DocumentNumber: 11; Revision: 2; SheetNumber: 11; SheetTotal: 13
Used 34 times, as channels ADC/Synchronous Demodulator Circuit/CH1/TIA1, ADC/Synchronous Demodulator Circuit/CH1/TIA2, ADC/Synchronous Demodulator Circuit/CH1/TIA3, ADC/Synchronous Demodulator Circuit/CH1/TIA4, ADC/Synchronous Demodulator Circuit/CH1/TIA5, ADC/Synchronous Demodulator Circuit/CH1/TIA6, ADC/Synchronous Demodulator Circuit/CH1/TIA7, ADC/Synchronous Demodulator Circuit/CH1/TIA8, ADC/Synchronous Demodulator Circuit/CH2/TIA1, ADC/Synchronous Demodulator Circuit/CH2/TIA2, ADC/Synchronous Demodulator Circuit/CH2/TIA3, ADC/Synchronous Demodulator Circuit/CH2/TIA4, ADC/Synchronous Demodulator Circuit/CH2/TIA5, ADC/Synchronous Demodulator Circuit/CH2/TIA6, ADC/Synchronous Demodulator Circuit/CH2/TIA7, ADC/Synchronous Demodulator Circuit/CH2/TIA8, ADC/Synchronous Demodulator Circuit/CH3/TIA1, ADC/Synchronous Demodulator Circuit/CH3/TIA2, ADC/Synchronous Demodulator Circuit/CH3/TIA3, ADC/Synchronous Demodulator Circuit/CH3/TIA4, ADC/Synchronous Demodulator Circuit/CH3/TIA5, ADC/Synchronous Demodulator Circuit/CH3/TIA6, ADC/Synchronous Demodulator Circuit/CH3/TIA7, ADC/Synchronous Demodulator Circuit/CH3/TIA8, ADC/Synchronous Demodulator Circuit/CH4/TIA1, ADC/Synchronous Demodulator Circuit/CH4/TIA2, ADC/Synchronous Demodulator Circuit/CH4/TIA3, ADC/Synchronous Demodulator Circuit/CH4/TIA4, ADC/Synchronous Demodulator Circuit/CH4/TIA5, ADC/Synchronous Demodulator Circuit/CH4/TIA6, ADC/Synchronous Demodulator Circuit/CH4/TIA7, ADC/Synchronous Demodulator Circuit/CH4/TIA8, ADC/Synchronous Demodulator Circuit/CH5/TIA_S1, ADC/Synchronous Demodulator Circuit/CH5/TIA_S2. Parts and nets are listed once, with the designators drawn on the sheet.
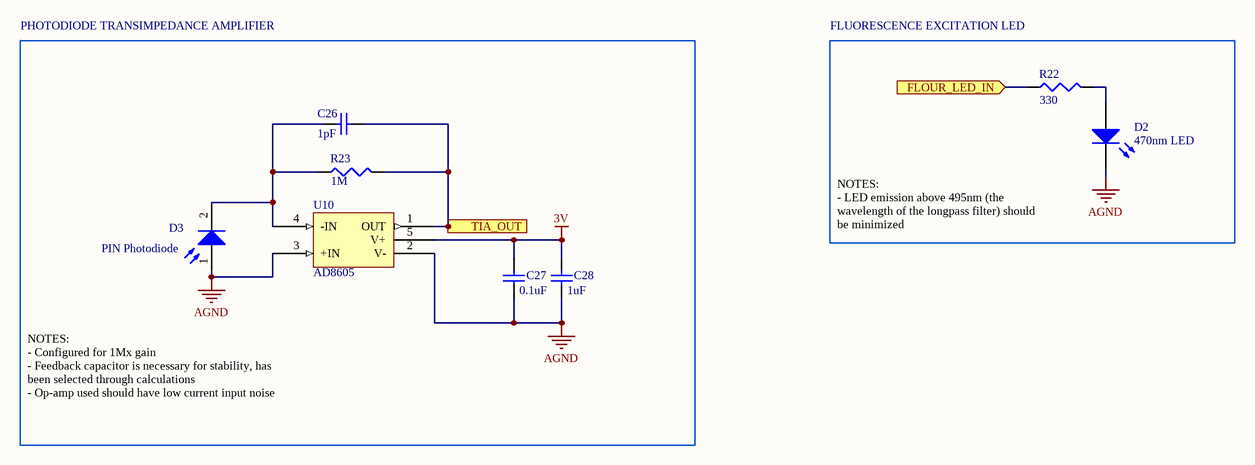
[diagram p6: photodiode-amplifier.SchDoc]

### Parts
C26  1pF  [0402]
C27  0.1uF  [0402]
C28  1uF  [1608[0603]]
D2  470nm LED  [LB P4SG]
D3  PIN Photodiode  [VBPW34SR]
R22  330  [0402]
R23  1M  [J1-0603]
U10  AD8605  [SOP-65P200X125-5N]

### Blocks framed on the sheet
PHOTODIODE TRANSIMPEDANCE AMPLIFIER: C26-C28 D3 R23 U10
FLUORESCENCE EXCITATION LED: D2 R22

### Ports
FLOUR_LED_IN (in), TIA_OUT (out)

### Nets
3V: C27.2 C28.2 U10.5(V+)
AGND: C27.1 C28.1 D2.2(K) D3.1(A) U10.2(V-) U10.3(+IN)
FLOUR_LED_IN: R22.1 ; port FLOUR_LED_IN
TIA_OUT: C26.2 R23.2 U10.1(OUT) ; port TIA_OUT
NetC26_1: C26.1 D3.2(K) R23.1 U10.4(-IN)
NetD2_1: D2.1(A) R22.2

### Channels
ADC/Synchronous Demodulator Circuit/CH1/TIA1: designators end in _TIA1; ports FLOUR_LED_IN=FL_LED1_CH1 TIA_OUT=TIA1_CH1
ADC/Synchronous Demodulator Circuit/CH1/TIA2: designators end in _TIA2; ports FLOUR_LED_IN=FL_LED2_CH1 TIA_OUT=TIA2_CH1
ADC/Synchronous Demodulator Circuit/CH1/TIA3: designators end in _TIA3; ports FLOUR_LED_IN=FL_LED3_CH1 TIA_OUT=TIA3_CH1
ADC/Synchronous Demodulator Circuit/CH1/TIA4: designators end in _TIA4; ports FLOUR_LED_IN=FL_LED4_CH1 TIA_OUT=TIA4_CH1
ADC/Synchronous Demodulator Circuit/CH1/TIA5: designators end in _TIA5; ports FLOUR_LED_IN=FL_LED5_CH1 TIA_OUT=TIA5_CH1
ADC/Synchronous Demodulator Circuit/CH1/TIA6: designators end in _TIA6; ports FLOUR_LED_IN=FL_LED6_CH1 TIA_OUT=TIA6_CH1
ADC/Synchronous Demodulator Circuit/CH1/TIA7: designators end in _TIA7; ports FLOUR_LED_IN=FL_LED7_CH1 TIA_OUT=TIA7_CH1
ADC/Synchronous Demodulator Circuit/CH1/TIA8: designators end in _TIA8; ports FLOUR_LED_IN=FL_LED8_CH1 TIA_OUT=TIA8_CH1
ADC/Synchronous Demodulator Circuit/CH2/TIA1: designators end in _TIA9; ports FLOUR_LED_IN=FL_LED1_CH2 TIA_OUT=TIA1_CH2
ADC/Synchronous Demodulator Circuit/CH2/TIA2: designators end in _TIA10; ports FLOUR_LED_IN=FL_LED2_CH2 TIA_OUT=TIA2_CH2
ADC/Synchronous Demodulator Circuit/CH2/TIA3: designators end in _TIA11; ports FLOUR_LED_IN=FL_LED3_CH2 TIA_OUT=TIA3_CH2
ADC/Synchronous Demodulator Circuit/CH2/TIA4: designators end in _TIA12; ports FLOUR_LED_IN=FL_LED4_CH2 TIA_OUT=TIA4_CH2
ADC/Synchronous Demodulator Circuit/CH2/TIA5: designators end in _TIA13; ports FLOUR_LED_IN=FL_LED5_CH2 TIA_OUT=TIA5_CH2
ADC/Synchronous Demodulator Circuit/CH2/TIA6: designators end in _TIA14; ports FLOUR_LED_IN=FL_LED6_CH2 TIA_OUT=TIA6_CH2
ADC/Synchronous Demodulator Circuit/CH2/TIA7: designators end in _TIA15; ports FLOUR_LED_IN=FL_LED7_CH2 TIA_OUT=TIA7_CH2
ADC/Synchronous Demodulator Circuit/CH2/TIA8: designators end in _TIA16; ports FLOUR_LED_IN=FL_LED8_CH2 TIA_OUT=TIA8_CH2
ADC/Synchronous Demodulator Circuit/CH3/TIA1: designators end in _TIA17; ports FLOUR_LED_IN=FL_LED1_CH3 TIA_OUT=TIA1_CH3
ADC/Synchronous Demodulator Circuit/CH3/TIA2: designators end in _TIA18; ports FLOUR_LED_IN=FL_LED2_CH3 TIA_OUT=TIA2_CH3
ADC/Synchronous Demodulator Circuit/CH3/TIA3: designators end in _TIA19; ports FLOUR_LED_IN=FL_LED3_CH3 TIA_OUT=TIA3_CH3
ADC/Synchronous Demodulator Circuit/CH3/TIA4: designators end in _TIA20; ports FLOUR_LED_IN=FL_LED4_CH3 TIA_OUT=TIA4_CH3
ADC/Synchronous Demodulator Circuit/CH3/TIA5: designators end in _TIA21; ports FLOUR_LED_IN=FL_LED5_CH3 TIA_OUT=TIA5_CH3
ADC/Synchronous Demodulator Circuit/CH3/TIA6: designators end in _TIA22; ports FLOUR_LED_IN=FL_LED6_CH3 TIA_OUT=TIA6_CH3
ADC/Synchronous Demodulator Circuit/CH3/TIA7: designators end in _TIA23; ports FLOUR_LED_IN=FL_LED7_CH3 TIA_OUT=TIA7_CH3
ADC/Synchronous Demodulator Circuit/CH3/TIA8: designators end in _TIA24; ports FLOUR_LED_IN=FL_LED8_CH3 TIA_OUT=TIA8_CH3
ADC/Synchronous Demodulator Circuit/CH4/TIA1: designators end in _TIA25; ports FLOUR_LED_IN=FL_LED1_CH4 TIA_OUT=TIA1_CH4
ADC/Synchronous Demodulator Circuit/CH4/TIA2: designators end in _TIA26; ports FLOUR_LED_IN=FL_LED2_CH4 TIA_OUT=TIA2_CH4
ADC/Synchronous Demodulator Circuit/CH4/TIA3: designators end in _TIA27; ports FLOUR_LED_IN=FL_LED3_CH4 TIA_OUT=TIA3_CH4
ADC/Synchronous Demodulator Circuit/CH4/TIA4: designators end in _TIA28; ports FLOUR_LED_IN=FL_LED4_CH4 TIA_OUT=TIA4_CH4
ADC/Synchronous Demodulator Circuit/CH4/TIA5: designators end in _TIA29; ports FLOUR_LED_IN=FL_LED5_CH4 TIA_OUT=TIA5_CH4
ADC/Synchronous Demodulator Circuit/CH4/TIA6: designators end in _TIA30; ports FLOUR_LED_IN=FL_LED6_CH4 TIA_OUT=TIA6_CH4
ADC/Synchronous Demodulator Circuit/CH4/TIA7: designators end in _TIA31; ports FLOUR_LED_IN=FL_LED7_CH4 TIA_OUT=TIA7_CH4
ADC/Synchronous Demodulator Circuit/CH4/TIA8: designators end in _TIA32; ports FLOUR_LED_IN=FL_LED8_CH4 TIA_OUT=TIA8_CH4
ADC/Synchronous Demodulator Circuit/CH5/TIA_S1: designators end in _TIA_S33; ports FLOUR_LED_IN=S_FL_LED1 TIA_OUT=S_TIA1
ADC/Synchronous Demodulator Circuit/CH5/TIA_S2: designators end in _TIA_S34; ports FLOUR_LED_IN=S_FL_LED2 TIA_OUT=S_TIA2

### Notes on the sheet
- NOTES:
  - LED emission above 495nm (the wavelength of the longpass filter) should be minimized
- NOTES:
  - Configured for 1Mx gain
  - Feedback capacitor is necessary for stability, has been selected through calculations
  - Op-amp used should have low current input noise

### Library data of the parts
C26 = Cap Semi: Feedback capacitor; Published: 8-Jun-2000; LatestRevisionDate: 29-May-2009; LatestRevisionNote: IPC-7351 Footprint Added.; PackageReference: C1206; Publisher: Altium Limited; PackageDescription: Chip Capacitor; Value: 1pF; Supplier: Digi-Key; Supplier 1: Digi-Key
C27 C28 = Cap Semi: Capacitor (Semiconductor SIM Model); Published: 8-Jun-2000; LatestRevisionDate: 29-May-2009; LatestRevisionNote: IPC-7351 Footprint Added.; PackageReference: C1206; Publisher: Altium Limited; PackageDescription: Chip Capacitor; Supplier: Digi-Key; Supplier 1: Digi-Key
  C27: Value: 0.1uF
  C28: Value: 1uF
D2 = LED2: as D1 on sheet pay-optical-toplevel; Published: 8-Jun-2000; LatestRevisionDate: 17-Jul-2002; LatestRevisionNote: Re-released for DXP Platform.; PackageVersion: Feb-2002; PackageReference: 3.2X1.6X1.1; Publisher: Altium Limited; PackageDescription: SM LED; 2 Flat Leads; Supplier Part Number: 475-2814-1-ND; Supplier: Digi-Key; Supplier 1: Digi-Key
D3 = Photo Sen: Photosensitive Diode; Published: 24-Mar-1999; LatestRevisionDate: 17-Jul-2002; LatestRevisionNote: Re-released for DXP Platform.; PackageReference: PIN2; Publisher: Altium Limited; Supplier Part Number: 751-1501-1-ND; Supplier: Digi-Key; Supplier 1: Digi-Key
R22 = Res3: Resistor; Published: 8-Jun-2000; LatestRevisionDate: 29-May-2009; LatestRevisionNote: IPC-7351 Footprint Added.; PackageReference: J1-0603; Publisher: Altium Limited; PackageDescription: Chip Resistor; Value: 330; Supplier: Digi-Key; Supplier 1: Digi-Key
R23 = Res3: 1 MOhm resistor for photodiode gain; Published: 8-Jun-2000; LatestRevisionDate: 29-May-2009; LatestRevisionNote: IPC-7351 Footprint Added.; PackageReference: J1-0603; Publisher: Altium Limited; PackageDescription: Chip Resistor; Value: 1M; Supplier: Digi-Key; Supplier 1: Digi-Key
U10 = AD8605: Low noise, precision rail-to-rail op-amp.; Supplier 1: Digi-Key; Supplier Part Number 1: AD8605ARTZREEL7CT-ND; Supplier: Digi-Key

## Sheet sync-demod-ic.SchDoc: ADA2200
size A4; DrawnBy: Dylan Vogel; Organization: UTAT SS; DocumentNumber: 10; Revision: 2; SheetNumber: 10; SheetTotal: 13
Used 4 times, as channels ADC/Synchronous Demodulator Circuit/SD1, ADC/Synchronous Demodulator Circuit/SD2, ADC/Synchronous Demodulator Circuit/SD3, ADC/Synchronous Demodulator Circuit/SD4. Parts and nets are listed once, with the designators drawn on the sheet.
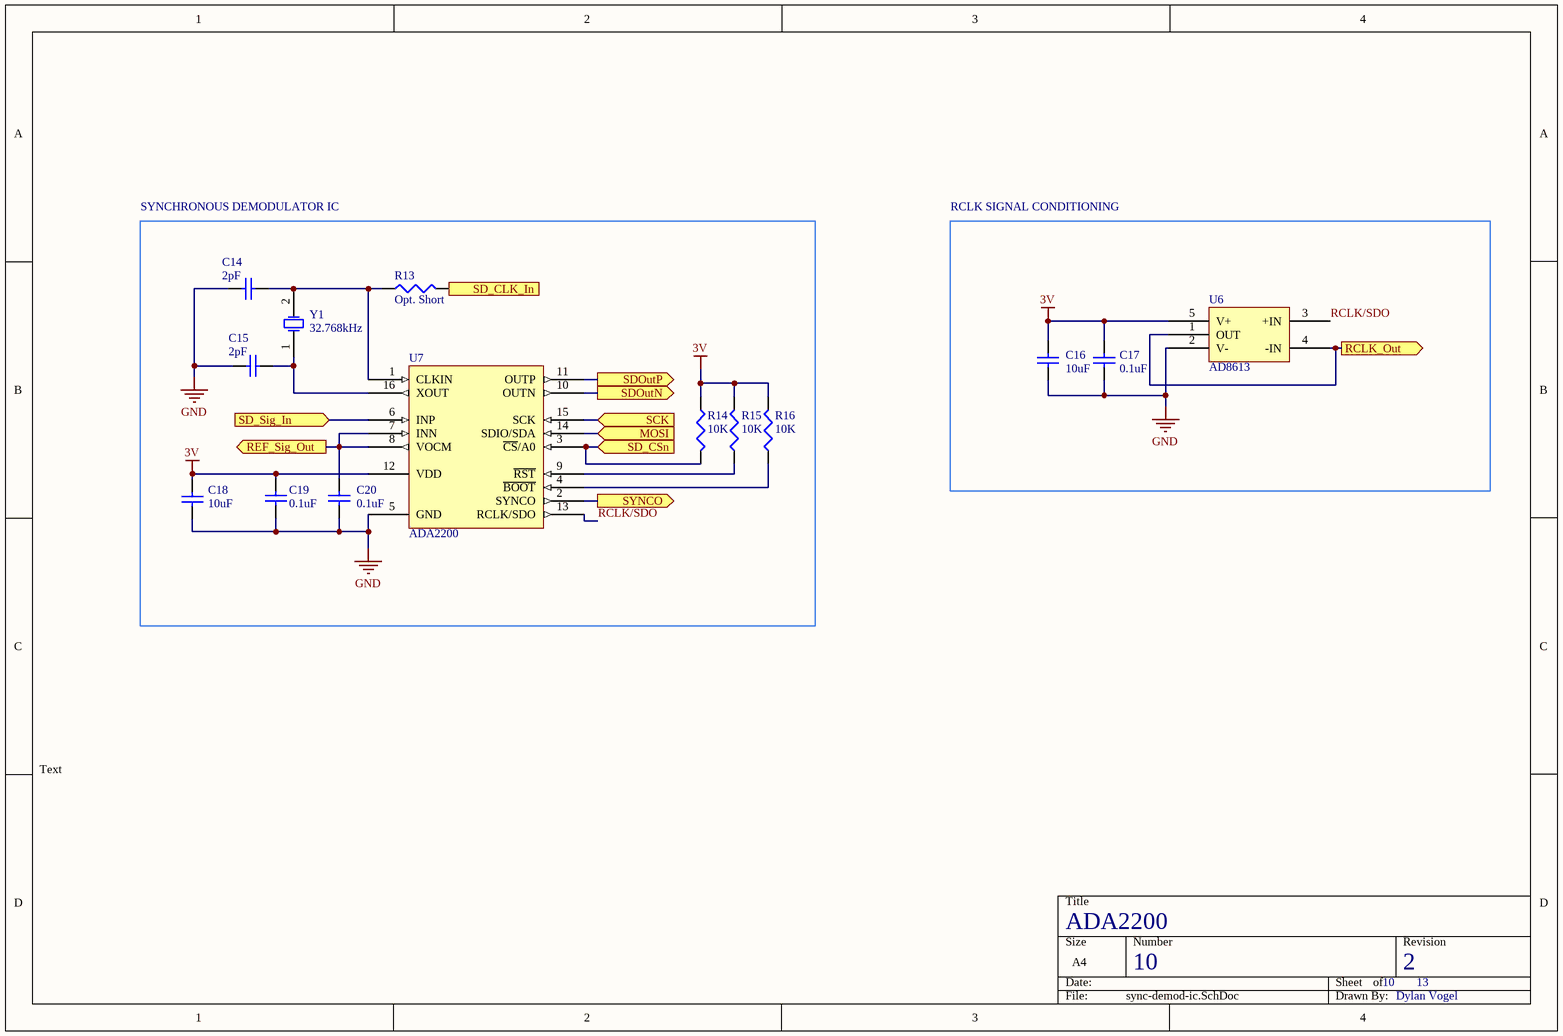
[diagram p7: sync-demod-ic.SchDoc]

### Parts
C14  2pF  [0402]
C15  2pF  [0402]
C16  10uF  [1608[0603]]
C17  0.1uF  [0402]
C18  10uF  [1608[0603]]
C19  0.1uF  [0402]
C20  0.1uF  [0402]
R13  Opt. Short  [0402]
R14  10K  [0402]
R15  10K  [0402]
R16  10K  [0402]
U6  AD8613  [SOP-65P200X125-5N]
U7  ADA2200  [SSOP16_N]
Y1  32.768kHz  [ABS07-120-32.768]

### Blocks framed on the sheet
SYNCHRONOUS DEMODULATOR IC: C14 C15 C18-C20 R13-R16 U7 Y1
RCLK SIGNAL CONDITIONING: C16 C17 U6

### Ports
MOSI (in), RCLK_Out (out), REF_Sig_Out (out), SCK (in), SD_CLK_In (in), SD_CSn (in), SD_Sig_In (in), SDOutN (out), SDOutP (out), SYNCO (out)

### Nets
3V: C16.2 C17.2 C18.1 C19.2 R14.1 R15.2 R16.2 U6.5(V+) U7.12(VDD)
GND: C14.2 C15.2 C16.1 C17.1 C18.2 C19.1 C20.1 U6.2(V-) U7.5(GND)
MOSI: U7.14(SDIO/SDA) ; port MOSI
RCLK/SDO: U6.3(+IN) U7.13(RCLK/SDO)  [project net RCLK/SDO_10]
RCLK_Out: U6.1(OUT) U6.4(-IN) ; port RCLK_Out
REF_Sig_Out: C20.2 U7.7(INN) U7.8(VOCM) ; port REF_Sig_Out
SCK: U7.15(SCK) ; port SCK
SD_CLK_In: R13.2 ; port SD_CLK_In
SD_CSn: R14.2 U7.3(~{CS}/A0) ; port SD_CSn
SD_Sig_In: U7.6(INP) ; port SD_Sig_In
SDOutN: U7.10(OUTN) ; port SDOutN
SDOutP: U7.11(OUTP) ; port SDOutP
SYNCO: U7.2(SYNCO) ; port SYNCO
NetC14_1: C14.1 R13.1 U7.1(CLKIN) Y1.2(OSC2)
NetC15_1: C15.1 U7.16(XOUT) Y1.1(OSC1)
NetR15_1: R15.1 U7.9(~{RST})
NetR16_1: R16.1 U7.4(~{BOOT})

### Channels
ADC/Synchronous Demodulator Circuit/SD1: designators end in _SD1; ports MOSI=MOSI RCLK_Out=LED_Sig1 REF_Sig_Out=REFSigO1 SCK=SCK SD_CLK_In=SD_CLKIN SD_CSn=SD_CSn1 SD_Sig_In=SDSigIn1 SDOutN=SDOutN1 SDOutP=SDOutP1 SYNCO=SYNCO1
ADC/Synchronous Demodulator Circuit/SD2: designators end in _SD2; ports MOSI=MOSI RCLK_Out=LED_Sig2 REF_Sig_Out=REFSigO2 SCK=SCK SD_CLK_In=SD_CLKIN SD_CSn=SD_CSn2 SD_Sig_In=SDSigIn2 SDOutN=SDOutN2 SDOutP=SDOutP2 SYNCO=SYNCO2
ADC/Synchronous Demodulator Circuit/SD3: designators end in _SD3; ports MOSI=MOSI RCLK_Out=LED_Sig3 REF_Sig_Out=REFSigO3 SCK=SCK SD_CLK_In=SD_CLKIN SD_CSn=SD_CSn3 SD_Sig_In=SDSigIn3 SDOutN=SDOutN3 SDOutP=SDOutP3 SYNCO=SYNCO3
ADC/Synchronous Demodulator Circuit/SD4: designators end in _SD4; ports MOSI=MOSI RCLK_Out=LED_Sig4 REF_Sig_Out=REFSigO4 SCK=SCK SD_CLK_In=SD_CLKIN SD_CSn=SD_CSn4 SD_Sig_In=SDSigIn4 SDOutN=SDOutN4 SDOutP=SDOutP4 SYNCO=SYNCO4

### Notes on the sheet
- Text

### Library data of the parts
C14-C20 = Cap Semi: Capacitor (Semiconductor SIM Model); Published: 8-Jun-2000; LatestRevisionDate: 29-May-2009; LatestRevisionNote: IPC-7351 Footprint Added.; PackageReference: C1206; Publisher: Altium Limited; PackageDescription: Chip Capacitor; Supplier: Digi-Key; Supplier 1: Digi-Key
  C14 C15: Value: 2pF
  C16 C18: Value: 10uF
  C17 C19 C20: Value: 0.1uF
R13 = Res3: Optional short to connect 32M1 rather than Y1; Value: 0 Ohm; Published: 8-Jun-2000; LatestRevisionDate: 29-May-2009; LatestRevisionNote: IPC-7351 Footprint Added.; PackageReference: J1-0603; Publisher: Altium Limited; PackageDescription: Chip Resistor; Supplier: Digi-Key; Supplier 1: Digi-Key
R14-R16 = Res3: Resistor; Published: 8-Jun-2000; LatestRevisionDate: 29-May-2009; LatestRevisionNote: IPC-7351 Footprint Added.; PackageReference: J1-0603; Publisher: Altium Limited; PackageDescription: Chip Resistor; Value: 10K; Supplier: Digi-Key; Supplier 1: Digi-Key
U6 = AD8613: Low power, low noise rail-to-rail op-amp.; Supplier: Digi-Key; Supplier 1: Digi-Key
U7 = ADA2200: Synchronous demodulator and configurable analog filter.; Supplier: Digi-Key; Supplier 1: Digi-Key
Y1 = XTAL: Crystal Oscillator; Published: 8-Jun-2000; LatestRevisionDate: 17-Jul-2002; LatestRevisionNote: Re-released for DXP Platform.; PackageReference: R38; Publisher: Altium Limited; PackageDescription: Crystal, Thru-Hole; 2 Leads; Body 3.1 x 8.2 mm (Dia.xH); Supplier: Digi-Key; Supplier Part Number: 535-11937-1-ND; Supplier 1: Digi-Key

## Sheet highpass-filter-conditioning.SchDoc: SD Input Highpass
size A4; DrawnBy: Dylan Vogel; Organization: UTAT SS; DocumentNumber: 9; Revision: 2; SheetNumber: 9; SheetTotal: 13
Used 4 times, as channels ADC/Synchronous Demodulator Circuit/HP_FILTER1, ADC/Synchronous Demodulator Circuit/HP_FILTER2, ADC/Synchronous Demodulator Circuit/HP_FILTER3, ADC/Synchronous Demodulator Circuit/HP_FILTER4. Parts and nets are listed once, with the designators drawn on the sheet.
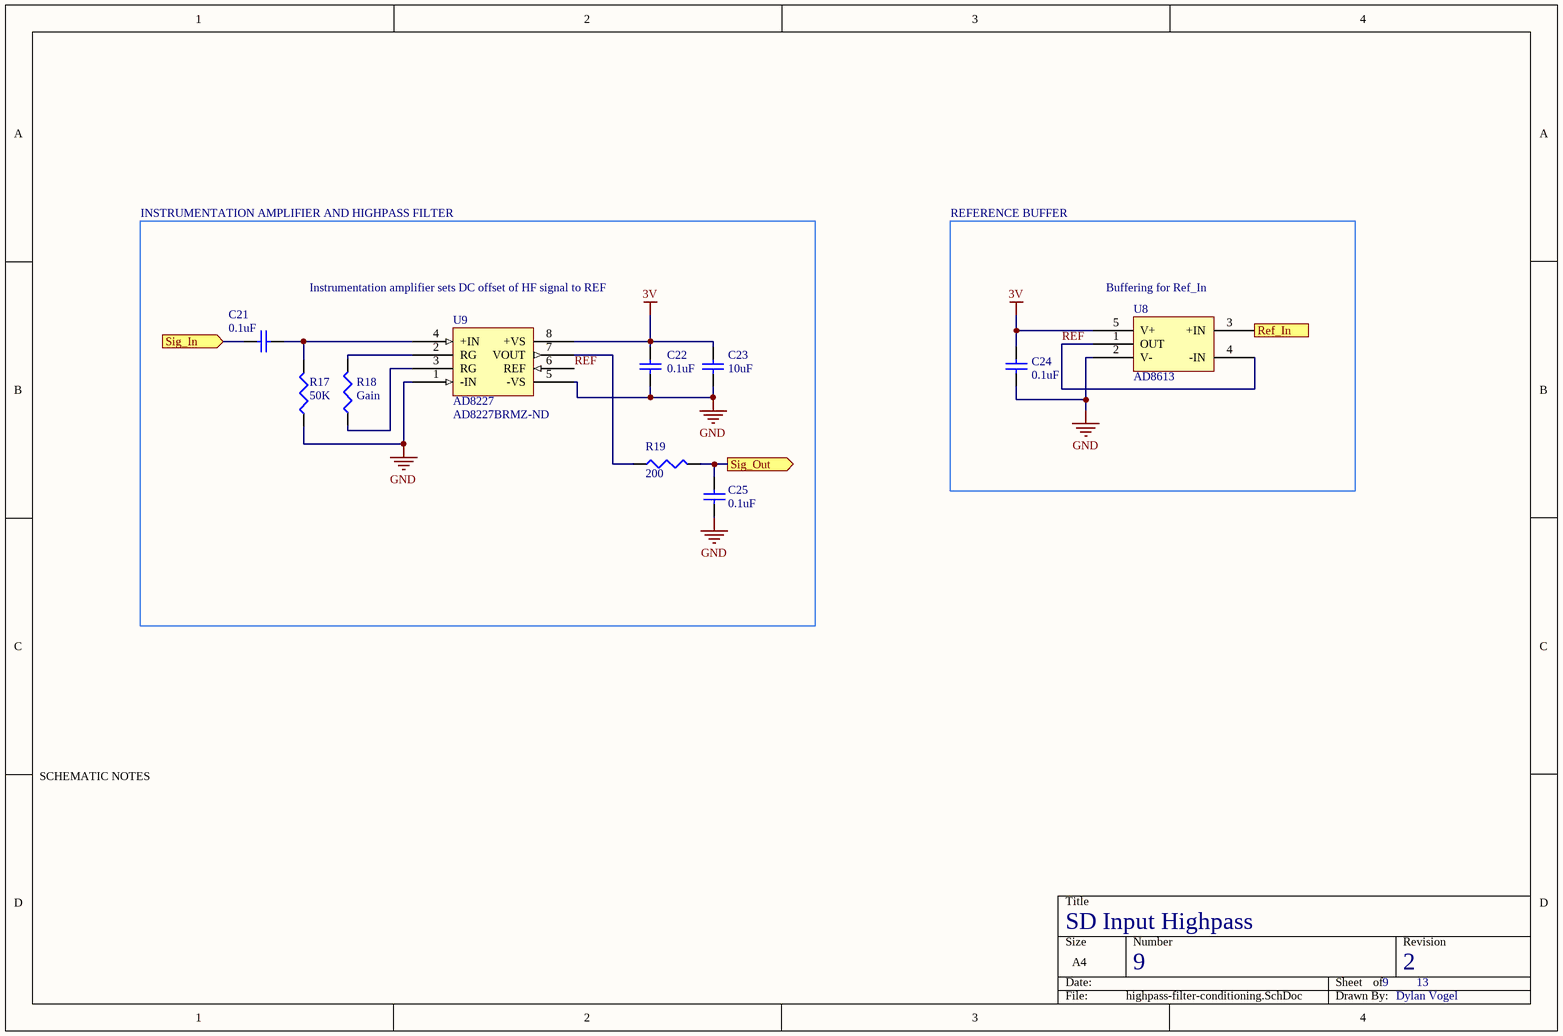
[diagram p8: highpass-filter-conditioning.SchDoc]

### Parts
C21  0.1uF  [0402]
C22  0.1uF  [0402]
C23  10uF  [1608[0603]]
C24  0.1uF  [0402]
C25  0.1uF  [0402]
R17  50K  [0402]
R18  Gain  [0402]
R19  200  [0402]
U8  AD8613  [SOP-65P200X125-5N]
U9  AD8227  Supplier Part Number 1: AD8227BRMZ-ND  [SOP8-65P300X300-8N]

### Ports
Ref_In (in), Sig_In (in), Sig_Out (out)

### Nets
3V: C22.2 C23.2 C24.2 U8.5(V+) U9.8(+VS)
GND: C22.1 C23.1 C24.1 C25.1 R17.1 U8.2(V-) U9.1(-IN) U9.5(-VS)
REF: U8.1(OUT) U8.4(-IN) U9.6(REF)  [project net REF_9]
Ref_In: U8.3(+IN) ; port Ref_In
Sig_In: C21.2 ; port Sig_In
Sig_Out: C25.2 R19.2 ; port Sig_Out
NetC21_1: C21.1 R17.2 U9.4(+IN)
NetR18_1: R18.1 U9.3(RG)
NetR18_2: R18.2 U9.2(RG)
NetR19_1: R19.1 U9.7(VOUT)

### Channels
ADC/Synchronous Demodulator Circuit/HP_FILTER1: designators end in _HP_FILTER1; ports Ref_In=REFSigO1 Sig_In=TIASigOut1 Sig_Out=SDSigIn1
ADC/Synchronous Demodulator Circuit/HP_FILTER2: designators end in _HP_FILTER2; ports Ref_In=REFSigO2 Sig_In=TIASigOut2 Sig_Out=SDSigIn2
ADC/Synchronous Demodulator Circuit/HP_FILTER3: designators end in _HP_FILTER3; ports Ref_In=REFSigO3 Sig_In=TIASigOut3 Sig_Out=SDSigIn3
ADC/Synchronous Demodulator Circuit/HP_FILTER4: designators end in _HP_FILTER4; ports Ref_In=REFSigO4 Sig_In=TIASigOut4 Sig_Out=SDSigIn4

### Notes on the sheet
- INSTRUMENTATION AMPLIFIER AND HIGHPASS FILTER
- REFERENCE BUFFER
- Instrumentation amplifier sets DC offset of HF signal to REF
- (near U8) Buffering for Ref_In
- Cut-off frequency is 32 Hz, minimal effect on phase of 500 Hz signal. AC coupling for instrumentation amplifier input.
- No resistor on RG sets 5x gain on amplifier.
- SCHEMATIC NOTES

### Library data of the parts
C21-C25 = Cap Semi: Capacitor (Semiconductor SIM Model); Published: 8-Jun-2000; LatestRevisionDate: 29-May-2009; LatestRevisionNote: IPC-7351 Footprint Added.; PackageReference: C1206; Publisher: Altium Limited; PackageDescription: Chip Capacitor; Supplier: Digi-Key; Supplier 1: Digi-Key
  C21 C22 C24 C25: Value: 0.1uF
  C23: Value: 10uF
R17 R19 = Res3: Resistor; Published: 8-Jun-2000; LatestRevisionDate: 29-May-2009; LatestRevisionNote: IPC-7351 Footprint Added.; PackageReference: J1-0603; Publisher: Altium Limited; PackageDescription: Chip Resistor; Supplier: Digi-Key; Supplier 1: Digi-Key
  R17: Value: 50K
  R19: Value: 200
R18 = Res3: Optional resistor sets instrumentation amplifier gain; Published: 8-Jun-2000; LatestRevisionDate: 29-May-2009; LatestRevisionNote: IPC-7351 Footprint Added.; PackageReference: J1-0603; Publisher: Altium Limited; PackageDescription: Chip Resistor; Supplier 1: Digi-Key
U8 = AD8613: as U6 on sheet sync-demod-ic; Supplier: Digi-Key; Supplier 1: Digi-Key
U9 = AD8227: Rail-to-rail instrumentation amplifier. Can operate on single supply.; Supplier 1: Digi-Key; Supplier: Digi-Key

## Sheet special-channel-selection.SchDoc: Special Channel Selection
size A4; DocumentNumber: 8; Revision: 2; SheetNumber: 8; SheetTotal: 13
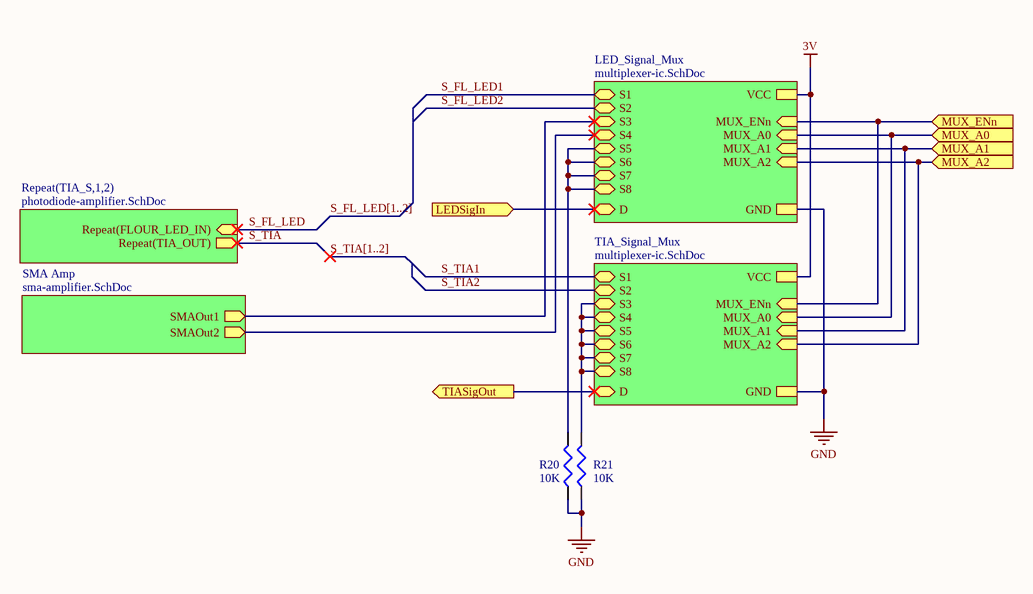
[diagram p9: special-channel-selection.SchDoc]

### Parts
R20  10K  [0402]
R21  10K  [0402]

### Sub-sheets
LED_Signal_Mux = multiplexer-ic.SchDoc: S7 (bidir), D (bidir), S3 (bidir), S1 (bidir), S4 (bidir), MUX_ENn (in), S2 (bidir), VCC, GND, S8 (bidir), S6 (bidir), MUX_A1 (in), MUX_A0 (in), S5 (bidir), MUX_A2 (in)
Repeat(TIA_S,1,2) = photodiode-amplifier.SchDoc: Repeat(TIA_OUT) (out), Repeat(FLOUR_LED_IN) (in)
SMA Amp = sma-amplifier.SchDoc: SMAOut1 (out), SMAOut2 (out)
TIA_Signal_Mux = multiplexer-ic.SchDoc: S7 (bidir), D (bidir), S3 (bidir), S1 (bidir), S4 (bidir), MUX_ENn (in), S2 (bidir), VCC, GND, S8 (bidir), S6 (bidir), MUX_A1 (in), MUX_A0 (in), S5 (bidir), MUX_A2 (in)

### Ports
LEDSigIn (in), MUX_A0 (in), MUX_A1 (in), MUX_A2 (in), MUX_ENn (in), TIASigOut (out)

### Nets
3V: sheet TIA_Signal_Mux/VCC, sheet LED_Signal_Mux/VCC
GND: R20.1 R21.1 ; sheet TIA_Signal_Mux/GND, sheet LED_Signal_Mux/GND
AIN2/P2: port MUX_A2, sheet TIA_Signal_Mux/MUX_A2, sheet LED_Signal_Mux/MUX_A2
AIN3/P1: port MUX_A1, sheet TIA_Signal_Mux/MUX_A1, sheet LED_Signal_Mux/MUX_A1
AIN4/P0: port MUX_A0, sheet TIA_Signal_Mux/MUX_A0, sheet LED_Signal_Mux/MUX_A0
LED_Sig4: port LEDSigIn, sheet LED_Signal_Mux/D
MUX_5_EN: port MUX_ENn, sheet TIA_Signal_Mux/MUX_ENn, sheet LED_Signal_Mux/MUX_ENn
S3: R21.2 ; sheet TIA_Signal_Mux/S7, sheet TIA_Signal_Mux/S3, sheet TIA_Signal_Mux/S4, sheet TIA_Signal_Mux/S8, sheet TIA_Signal_Mux/S6, sheet TIA_Signal_Mux/S5
S3: sheet LED_Signal_Mux/S3, sheet SMA Amp/SMAOut1  [a separate net that carries the same name]
S4: sheet LED_Signal_Mux/S4, sheet SMA Amp/SMAOut2
S5: R20.2 ; sheet LED_Signal_Mux/S7, sheet LED_Signal_Mux/S8, sheet LED_Signal_Mux/S6, sheet LED_Signal_Mux/S5
S_FL_LED: sheet Repeat(TIA_S,1,2)/Repeat(FLOUR_LED_IN)
S_TIA: sheet Repeat(TIA_S,1,2)/Repeat(TIA_OUT)
TIASigOut4: port TIASigOut, sheet TIA_Signal_Mux/D

### Buses and harness runs
bus S_FL_LED[1..2]
bus S_TIA[1..2]

### Library data of the parts
R20 R21 = Res3: Resistor; Published: 8-Jun-2000; LatestRevisionDate: 29-May-2009; LatestRevisionNote: IPC-7351 Footprint Added.; PackageReference: J1-0603; Publisher: Altium Limited; PackageDescription: Chip Resistor; Value: 10K; Supplier 1: Digi-Key

## Sheet sma-amplifier.SchDoc: SMA Amplifier
size A4; DrawnBy: Dylan Vogel; Organization: UTAT SS; DocumentNumber: 12; Revision: 2; SheetNumber: 12; SheetTotal: 13
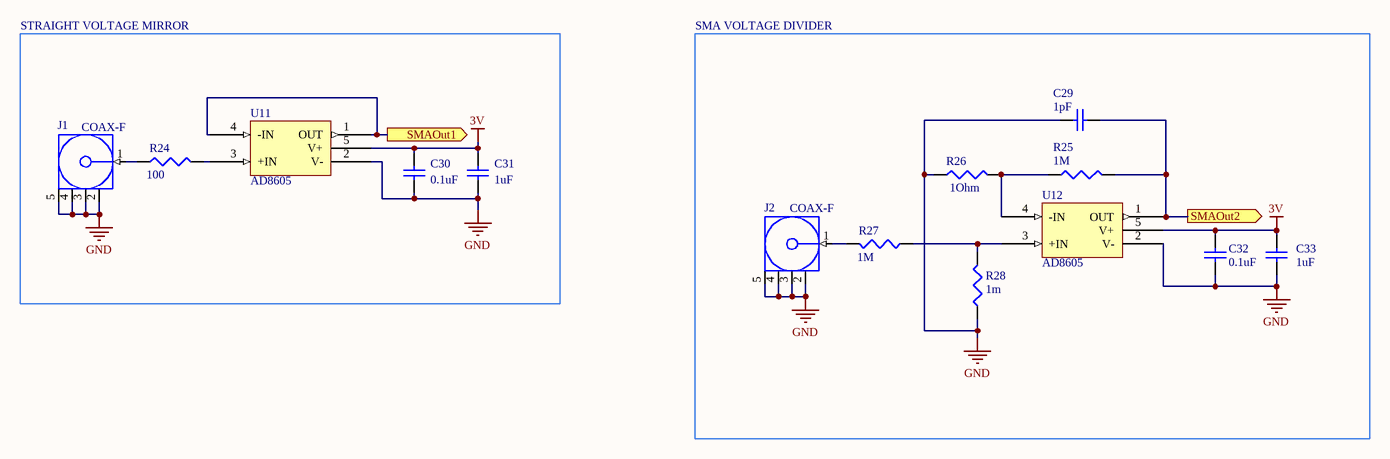
[diagram p10: sma-amplifier.SchDoc]

### Parts
C29  1pF  [0402]
C30  0.1uF  [0402]
C31  1uF  [1608[0603]]
C32  0.1uF  [0402]
C33  1uF  [1608[0603]]
J1  COAX-F  [MCX5.08-H5]
J2  COAX-F  [MCX5.08-H5]
R24  100  [0402]
R25  1M  [0402]
R26  1Ohm  [J1-0603]
R27  1M  [0402]
R28  1m  [14-1210]
U11  AD8605  [SOP-65P200X125-5N]
U12  AD8605  [SOP-65P200X125-5N]

### Blocks framed on the sheet
STRAIGHT VOLTAGE MIRROR: C30 C31 J1 R24 U11
SMA VOLTAGE DIVIDER: C29 C32 C33 J2 R25-R28 U12

### Ports
SMAOut1 (out), SMAOut2 (out)

### Nets
3V: C30.2 C31.2 C32.2 C33.2 U11.5(V+) U12.5(V+)
GND: C29.2 C30.1 C31.1 C32.1 C33.1 J1.2(GND) J1.3(GND) J1.4(GND) J1.5(GND) J2.2(GND) J2.3(GND) J2.4(GND) J2.5(GND) R26.1 R28.1 U11.2(V-) U12.2(V-)
S3: U11.1(OUT) U11.4(-IN) ; port SMAOut1
S4: C29.1 R25.2 U12.1(OUT) ; port SMAOut2
NetJ1_1: J1.1(Signal) R24.1
NetJ2_1: J2.1(Signal) R27.2
NetR24_2: R24.2 U11.3(+IN)
NetR25_1: R25.1 R26.2 U12.4(-IN)
NetR27_1: R27.1 R28.2 U12.3(+IN)

### Library data of the parts
C29-C33 = Cap Semi: Capacitor (Semiconductor SIM Model); Published: 8-Jun-2000; LatestRevisionDate: 29-May-2009; LatestRevisionNote: IPC-7351 Footprint Added.; PackageReference: C1206; Publisher: Altium Limited; PackageDescription: Chip Capacitor; Supplier: Digi-Key; Supplier 1: Digi-Key
  C29: Value: 1pF
  C30 C32: Value: 0.1uF
  C31 C33: Value: 1uF
J1 J2 = COAX-F: RF Coaxial PCB Connector, MCX; Thru-Hole, Right-Angle Mount Socket, Blunt Post Terminal, 50 Ohm Impedance; PCB_Layout: Complies with manufacturer's recommendation.; DrillSize: Corresponds to nominal value.; Published: 15-Jul-2004; LatestRevisionDate: 15-Jul-2004; LatestRevisionNote: Component Replaced.; DatasheetDocument: 30-May-2003; PackageDocument: 04-Jul-1999; PackageReference: 919-119J-51AX; Publisher: Altium Limited; ComponentLink1Description: Manufacturer Link; ComponentLink1URL: http://www.amphenolrf.com/; Supplier 1: Digi-Key
R24-R28 = Res3: Resistor; Published: 8-Jun-2000; LatestRevisionDate: 29-May-2009; LatestRevisionNote: IPC-7351 Footprint Added.; PackageReference: J1-0603; Publisher: Altium Limited; PackageDescription: Chip Resistor; Supplier 1: Digi-Key
  R24: Value: 100
  R25 R27: Value: 1M
  R26: Value: 1Ohm
  R28: Value: 1m
U11 U12 = AD8605: as U10 on sheet photodiode-amplifier; Supplier 1: Digi-Key; Supplier Part Number 1: AD8605ARTZREEL7CT-ND; Supplier: Digi-Key

## Sheet lowpass-adc-input.SchDoc: ADC Input Lowpass
size A4; DrawnBy: Dylan Vogel; Organization: UTAT SS; DocumentNumber: 5; Revision: 2; SheetNumber: 5; SheetTotal: 13
Used 8 times, as channels ADC/LPF_P1, ADC/LPF_P2, ADC/LPF_P3, ADC/LPF_P4, ADC/LPF_N1, ADC/LPF_N2, ADC/LPF_N3, ADC/LPF_N4. Parts and nets are listed once, with the designators drawn on the sheet.
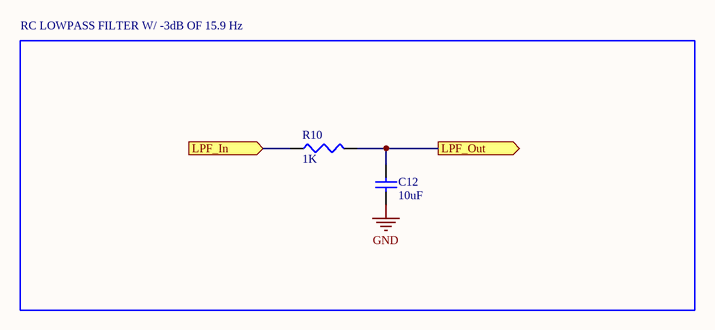
[diagram p11: lowpass-adc-input.SchDoc]

### Parts
C12  10uF  [C1206]
R10  1K  [J1-0603]

### Blocks framed on the sheet
RC LOWPASS FILTER W/ -3dB OF 15.9 Hz: C12 R10

### Ports
LPF_In (in), LPF_Out (out)

### Nets
GND: C12.1
LPF_In: R10.1 ; port LPF_In
LPF_Out: C12.2 R10.2 ; port LPF_Out

### Channels
ADC/LPF_P1: designators end in _LPF_P5; ports LPF_In=SDOutP1 LPF_Out=LPF_P1
ADC/LPF_P2: designators end in _LPF_P6; ports LPF_In=SDOutP2 LPF_Out=LPF_P2
ADC/LPF_P3: designators end in _LPF_P7; ports LPF_In=SDOutP3 LPF_Out=LPF_P3
ADC/LPF_P4: designators end in _LPF_P8; ports LPF_In=SDOutP4 LPF_Out=LPF_P4
ADC/LPF_N1: designators end in _LPF_N1; ports LPF_In=SDOutN1 LPF_Out=LPF_N1
ADC/LPF_N2: designators end in _LPF_N2; ports LPF_In=SDOutN2 LPF_Out=LPF_N2
ADC/LPF_N3: designators end in _LPF_N3; ports LPF_In=SDOutN3 LPF_Out=LPF_N3
ADC/LPF_N4: designators end in _LPF_N4; ports LPF_In=SDOutN4 LPF_Out=LPF_N4

### Library data of the parts
C12 = Cap Semi: Capacitor (Semiconductor SIM Model); Published: 8-Jun-2000; LatestRevisionDate: 29-May-2009; LatestRevisionNote: IPC-7351 Footprint Added.; PackageReference: C1206; Publisher: Altium Limited; PackageDescription: Chip Capacitor; Value: 10uF
R10 = Res3: Resistor; Published: 8-Jun-2000; LatestRevisionDate: 29-May-2009; LatestRevisionNote: IPC-7351 Footprint Added.; PackageReference: J1-0603; Publisher: Altium Limited; PackageDescription: Chip Resistor; Value: 1K

## Sheet dac-ic.SchDoc: DAC7562
size A4; DrawnBy: Dylan Vogel; Organization: UTAT SS; DocumentNumber: 4; Revision: 1; SheetNumber: 4; SheetTotal: 13
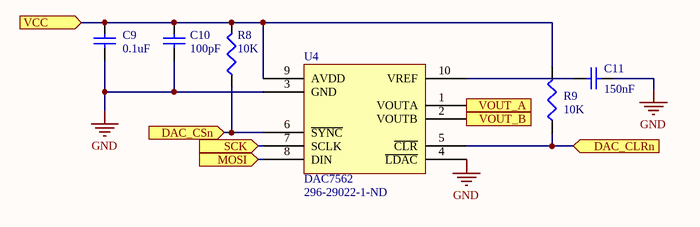
[diagram p12: dac-ic.SchDoc]

### Parts
C9  0.1uF  [0402]
C10  100pF  [0402]
C11  150nF  [0402]
R8  10K  [0402]
R9  10K  [0402]
U4  DAC7562  Supplier Part Number 1: 296-29022-1-ND  [SOP10-50P300X300-10N]

### Ports
DAC_CLRn (in), DAC_CSn (in), MOSI (in), SCK (in), VCC (in), VOUT_A (out), VOUT_B (out)

### Nets
3V: C9.2 C10.2 R8.2 R9.2 U4.9(AVDD) ; port VCC
GND: C9.1 C10.1 C11.2 U4.3(GND) U4.4(~{LDAC})
AIN15: U4.1(VOUTA) ; port VOUT_A
AIN16: U4.2(VOUTB) ; port VOUT_B
DAC_CLRn: R9.1 U4.5(~{CLR}) ; port DAC_CLRn
DAC_CSn: R8.1 U4.6(~{SYNC}) ; port DAC_CSn
MOSI: U4.8(DIN) ; port MOSI
SCK: U4.7(SCLK) ; port SCK
NetC11_1: C11.1 U4.10(VREF)

### Library data of the parts
C9-C11 = Cap Semi: Capacitor (Semiconductor SIM Model); Published: 8-Jun-2000; LatestRevisionDate: 29-May-2009; LatestRevisionNote: IPC-7351 Footprint Added.; PackageReference: C1206; Publisher: Altium Limited; PackageDescription: Chip Capacitor; Supplier: Digi-Key; Supplier 1: Digi-Key
  C9: Value: 0.1uF; Supplier Part Number: 587-3807-1-ND
  C10: Value: 100pF; Supplier Part Number: 1276-1632-1-ND
  C11: Value: 150nF; Supplier Part Number: 1276-1972-1-ND
R8 R9 = Res3: Resistor; Published: 8-Jun-2000; LatestRevisionDate: 29-May-2009; LatestRevisionNote: IPC-7351 Footprint Added.; PackageReference: J1-0603; Publisher: Altium Limited; PackageDescription: Chip Resistor; Value: 10K; Supplier: Digi-Key; Supplier 1: Digi-Key
U4 = DAC7562: 12-bit, low-power, voltage-output DAC with internal reference.; Supplier 1: Digi-Key; Supplier: Digi-Key